# EAGLE schematic MainECU rev14 (EAGLE 9.6.2)

## Sheet 1 of 8
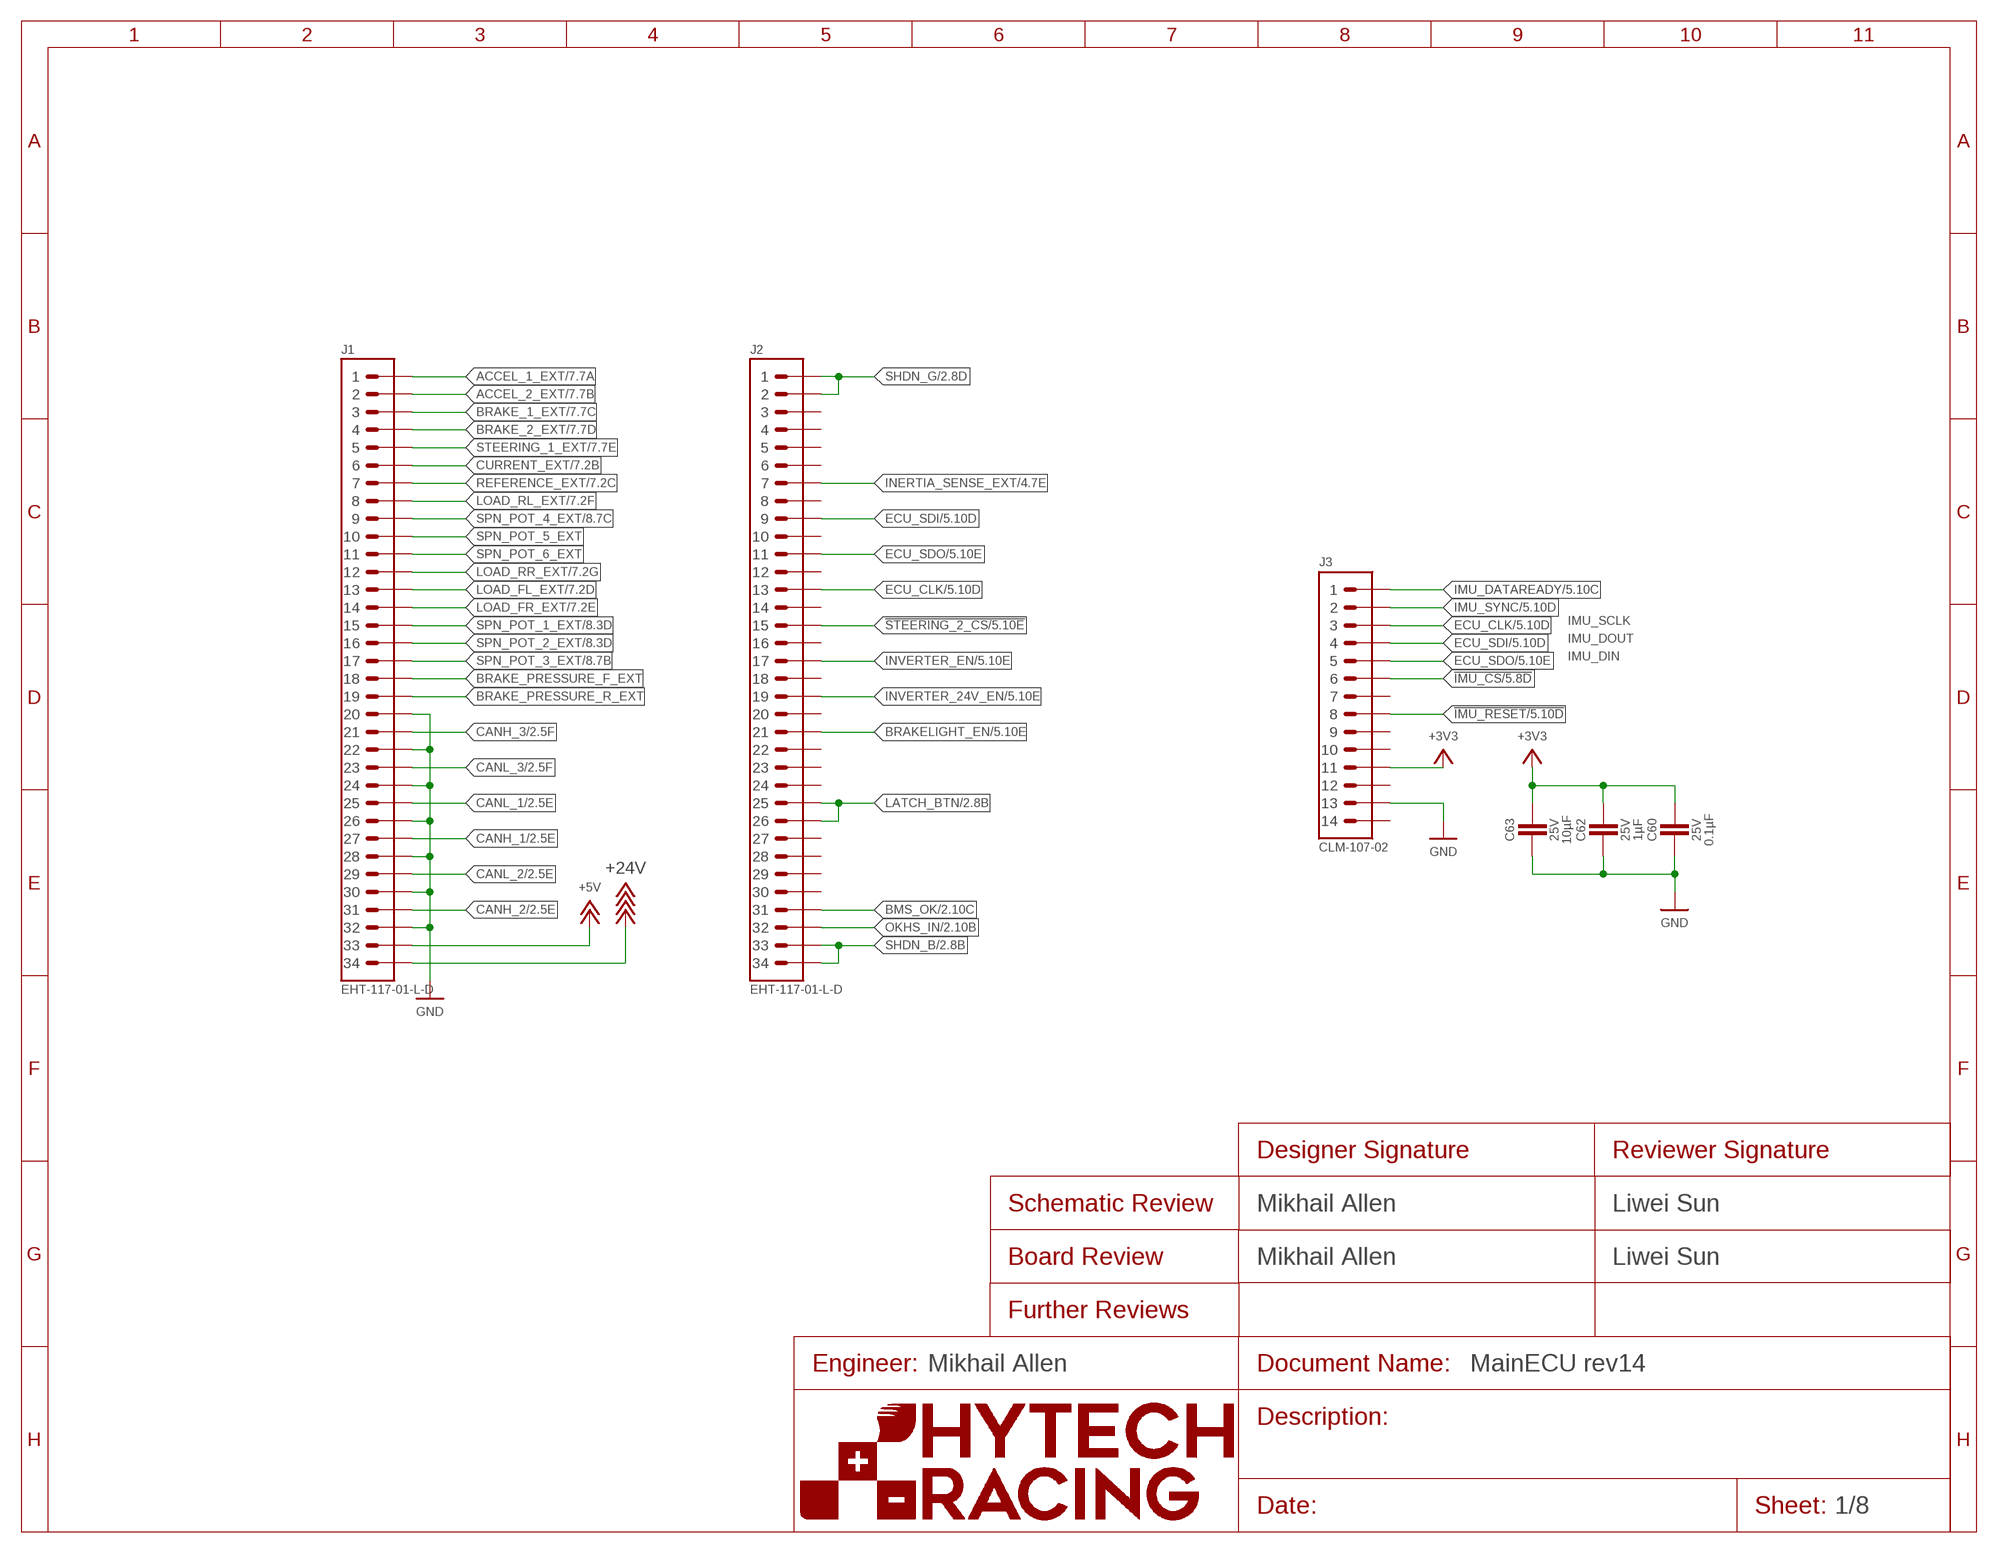
[diagram p0: schematic, sheet 1]
FRAME8 (FRAME): DESIGNER_BOARD: Mikhail Allen; DESIGNER_SCHEMATIC: Mikhail Allen; ENGINEER: Mikhail Allen; REVIEWER_BOARD: Liwei Sun; REVIEWER_SCHEMATIC: Liwei Sun

### Parts
C60  CAPACITOR_0603_25V_0.1UF  [0603-CAP]
C62  CAPACITOR_0603_25V_1UF  [0603-CAP]
C63  CAPACITOR_0603_25V_10UF  [0603-CAP]
J1  CONNECTOR-34__  [EHT-117-01]
J2  CONNECTOR-34__  [EHT-117-01]
J3  ADIS16460  [ADIS16460]

### Nets
!IMU_CS: J3.6 ; also sheet 5
!IMU_RESET: J3.8 ; also sheet 5
!STEERING_2_CS: J2.15 ; also sheet 5
+3V3: C60.1 C62.1 C63.1 J3.11 ; also sheet 2,3,4,5,6
+5V: J1.33 ; also sheet 2,3,5,6,7
+24V: J1.34 ; also sheet 2,3,4,5
ACCEL_1_EXT: J1.1 ; also sheet 7
ACCEL_2_EXT: J1.2 ; also sheet 7
BMS_OK: J2.31 ; also sheet 2,4
BRAKE_1_EXT: J1.3 ; also sheet 7
BRAKE_2_EXT: J1.4 ; also sheet 7
BRAKE_PRESSURE_F_EXT: J1.18
BRAKE_PRESSURE_R_EXT: J1.19
BRAKELIGHT_EN: J2.21 ; also sheet 5
CANH_1: J1.27 ; also sheet 2,5,6
CANH_2: J1.31 ; also sheet 2,5,6
CANH_3: J1.21 ; also sheet 2,5,6
CANL_1: J1.25 ; also sheet 2,5,6
CANL_2: J1.29 ; also sheet 2,5,6
CANL_3: J1.23 ; also sheet 2,5,6
CURRENT_EXT: J1.6 ; also sheet 7
ECU_CLK: J2.13 J3.3 ; also sheet 5
ECU_SDI: J2.9 J3.4 ; also sheet 5
ECU_SDO: J2.11 J3.5 ; also sheet 5
GND: C60.2 C62.2 C63.2 J1.20 J1.22 J1.24 J1.26 J1.28 J1.30 J1.32 J3.13 ; also sheet 2,3,4,5,6,7,8
IMU_DATAREADY: J3.1 ; also sheet 5
IMU_SYNC: J3.2 ; also sheet 5
INERTIA_SENSE_EXT: J2.7 ; also sheet 4
INVERTER_24V_EN: J2.19 ; also sheet 5
INVERTER_EN: J2.17 ; also sheet 5
LATCH_BTN: J2.25 J2.26 ; also sheet 2,4
LOAD_FL_EXT: J1.13 ; also sheet 7
LOAD_FR_EXT: J1.14 ; also sheet 7
LOAD_RL_EXT: J1.8 ; also sheet 7
LOAD_RR_EXT: J1.12 ; also sheet 7
OKHS_IN: J2.32 ; also sheet 2,4
REFERENCE_EXT: J1.7 ; also sheet 7
SHDN_B: J2.33 J2.34 ; also sheet 2,4
SHDN_G: J2.1 J2.2 ; also sheet 2,4
SPN_POT_1_EXT: J1.15 ; also sheet 8
SPN_POT_2_EXT: J1.16 ; also sheet 8
SPN_POT_3_EXT: J1.17 ; also sheet 8
SPN_POT_4_EXT: J1.9 ; also sheet 8
SPN_POT_5_EXT: J1.10
SPN_POT_6_EXT: J1.11
STEERING_1_EXT: J1.5 ; also sheet 7
Unconnected: J2.3 J2.4 J2.5 J2.6 J2.8 J2.10 J2.12 J2.14 J2.16 J2.18 J2.20 J2.22 J2.23 J2.24 J2.27 J2.28 J2.29 J2.30 J3.7 J3.9 J3.10 J3.12 J3.14

### Notes on the sheet
- IMU_SCLK
- IMU_DOUT
- IMU_DIN

## Sheet 2 of 8
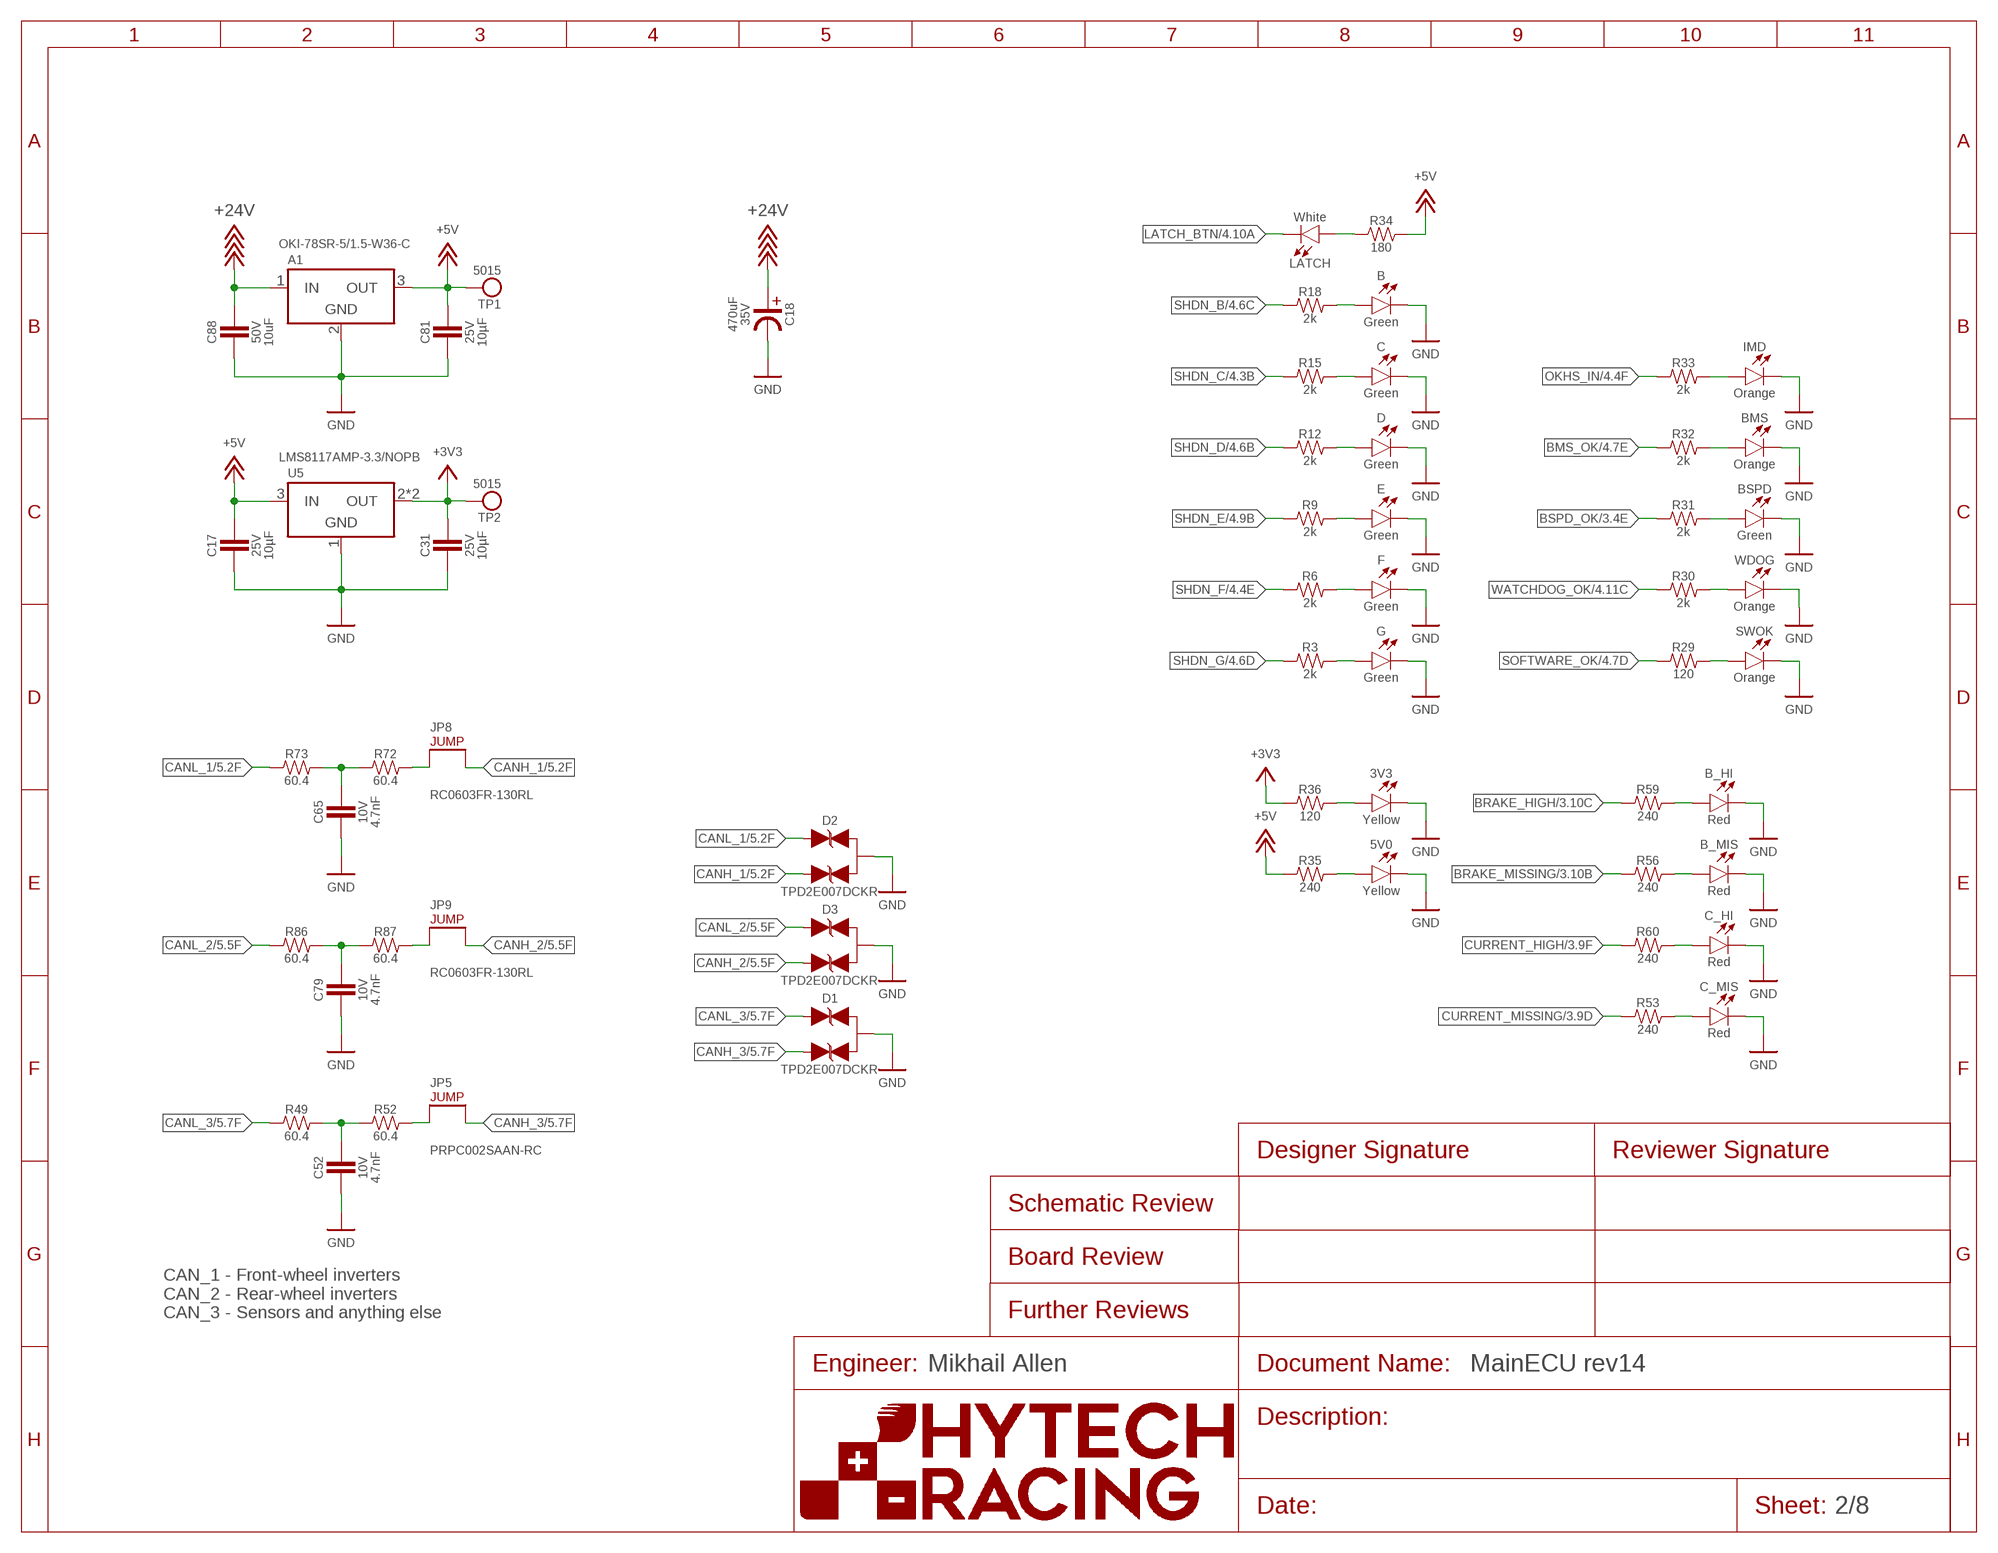
[diagram p1: schematic, sheet 2]
FRAME1 (FRAME): ENGINEER: Mikhail Allen

### Parts
3V3  LED_0603_YELLOW  [0603-LED]
5V0  LED_0603_YELLOW  [0603-LED]
A1  VOLTAGE_REGULATOR_MODULE_OKI-78SR_5V  [OKI-78SR]
B  LED_0603_GREEN  [0603-LED]
B_HI  LED_0603_RED  [0603-LED]
B_MIS  LED_0603_RED  [0603-LED]
BMS  LED_0603_ORANGE  [0603-LED]
BSPD  LED_0603_GREEN  [0603-LED]
C  LED_0603_GREEN  [0603-LED]
C17  CAPACITOR_0603_25V_10UF  [0603-CAP]
C18  CAPACITOR_ELECTROLYTIC_EEH_AZS_470UF  [EEH-AZS]
C31  CAPACITOR_0603_25V_10UF  [0603-CAP]
C52  CAPACITOR_0603_10V_4.7NF  [0603-CAP]
C65  CAPACITOR_0603_10V_4.7NF  [0603-CAP]
C79  CAPACITOR_0603_10V_4.7NF  [0603-CAP]
C81  CAPACITOR_0603_25V_10UF  [0603-CAP]
C88  CAPACITOR_0805_50V_10UF  [0805-CAP]
C_HI  LED_0603_RED  [0603-LED]
C_MIS  LED_0603_RED  [0603-LED]
D  LED_0603_GREEN  [0603-LED]
D1  TVS_BIDIRECTIONAL_DUAL  [SC-70-3]
D2  TVS_BIDIRECTIONAL_DUAL  [SC-70-3]
D3  TVS_BIDIRECTIONAL_DUAL  [SC-70-3]
E  LED_0603_GREEN  [0603-LED]
F  LED_0603_GREEN  [0603-LED]
G  LED_0603_GREEN  [0603-LED]
IMD  LED_0603_ORANGE  [0603-LED]
JP5  JUMPER__1X02  [1X02]
JP8  JUMPER_0603_  [0603-RES]
JP9  JUMPER_0603_  [0603-RES]
LATCH  LED_0603_WHITE  [0603-LED]
R3  RESISTOR_0603_2K  [0603-RES]
R6  RESISTOR_0603_2K  [0603-RES]
R9  RESISTOR_0603_2K  [0603-RES]
R12  RESISTOR_0603_2K  [0603-RES]
R15  RESISTOR_0603_2K  [0603-RES]
R18  RESISTOR_0603_2K  [0603-RES]
R29  RESISTOR_0603_120  [0603-RES]
R30  RESISTOR_0603_2K  [0603-RES]
R31  RESISTOR_0603_2K  [0603-RES]
R32  RESISTOR_0603_2K  [0603-RES]
R33  RESISTOR_0603_2K  [0603-RES]
R34  RESISTOR_0603_180  [0603-RES]
R35  RESISTOR_0603_240  [0603-RES]
R36  RESISTOR_0603_120  [0603-RES]
R49  RESISTOR_0603_60.4  [0603-RES]
R52  RESISTOR_0603_60.4  [0603-RES]
R53  RESISTOR_0603_240  [0603-RES]
R56  RESISTOR_0603_240  [0603-RES]
R59  RESISTOR_0603_240  [0603-RES]
R60  RESISTOR_0603_240  [0603-RES]
R72  RESISTOR_0603_60.4  [0603-RES]
R73  RESISTOR_0603_60.4  [0603-RES]
R86  RESISTOR_0603_60.4  [0603-RES]
R87  RESISTOR_0603_60.4  [0603-RES]
SWOK  LED_0603_ORANGE  [0603-LED]
TP1  TEST_POINT  [5015]
TP2  TEST_POINT  [5015]
U5  VOLTAGE_REGULATOR_SOT-223_3.3V  [SOT-223]
WDOG  LED_0603_ORANGE  [0603-LED]

### Nets
+3V3: C31.1 R36.1 TP2.1 U5.2(OUT) U5.4(OUT) ; also sheet 1,3,4,5,6
+5V: A1.3(OUT) C17.1 C81.1 R34.2 R35.1 TP1.1 U5.3(IN) ; also sheet 1,3,5,6,7
+24V: A1.1(IN) C18.PLUS C88.1 ; also sheet 1,3,4,5
BMS_OK: R32.1 ; also sheet 1,4
BRAKE_HIGH: R59.1 ; also sheet 3
BRAKE_MISSING: R56.1 ; also sheet 3
BSPD_OK: R31.1 ; also sheet 3,4
CANH_1: D2.2(C2) JP8.2 ; also sheet 1,5,6
CANH_2: D3.2(C2) JP9.2 ; also sheet 1,5,6
CANH_3: D1.2(C2) JP5.2 ; also sheet 1,5,6
CANL_1: D2.1(C1) R73.1 ; also sheet 1,5,6
CANL_2: D3.1(C1) R86.1 ; also sheet 1,5,6
CANL_3: D1.1(C1) R49.1 ; also sheet 1,5,6
CURRENT_HIGH: R60.1 ; also sheet 3
CURRENT_MISSING: R53.1 ; also sheet 3
GND: 3V3.1(C) 5V0.1(C) A1.2(GND) B.1(C) B_HI.1(C) B_MIS.1(C) BMS.1(C) BSPD.1(C) C17.2 C18.MINUS C31.2 C52.2 C65.2 C79.2 C81.2 C88.2 C.1(C) C_HI.1(C) C_MIS.1(C) D1.3(A) D2.3(A) D3.3(A) D.1(C) E.1(C) F.1(C) G.1(C) IMD.1(C) SWOK.1(C) U5.1(GND) WDOG.1(C) ; also sheet 1,3,4,5,6,7,8
LATCH_BTN: LATCH.1(C) ; also sheet 1,4
N$1: JP8.1 R72.2
N$2: JP9.1 R87.2
N$6: JP5.1 R52.2
N$7: C79.1 R86.2 R87.1
N$8: C52.1 R49.2 R52.1
N$9: C65.1 R72.1 R73.2
N$13: G.2(A) R3.2
N$15: LATCH.2(A) R34.1
N$16: B.2(A) R18.2
N$17: C.2(A) R15.2
N$18: D.2(A) R12.2
N$19: E.2(A) R9.2
N$20: F.2(A) R6.2
N$28: B_MIS.2(A) R56.2
N$29: C_HI.2(A) R60.2
N$30: C_MIS.2(A) R53.2
N$40: IMD.2(A) R33.2
N$41: BMS.2(A) R32.2
N$42: BSPD.2(A) R31.2
N$43: R30.2 WDOG.2(A)
N$44: 3V3.2(A) R36.2
N$45: R29.2 SWOK.2(A)
N$47: 5V0.2(A) R35.2
N$56: B_HI.2(A) R59.2
OKHS_IN: R33.1 ; also sheet 1,4
SHDN_B: R18.1 ; also sheet 1,4
SHDN_C: R15.1 ; also sheet 4
SHDN_D: R12.1 ; also sheet 4
SHDN_E: R9.1 ; also sheet 4
SHDN_F: R6.1 ; also sheet 4
SHDN_G: R3.1 ; also sheet 1,4
SOFTWARE_OK: R29.1 ; also sheet 4,5
WATCHDOG_OK: R30.1 ; also sheet 4

### Notes on the sheet
- CAN_1 - Front-wheel inverters
  CAN_2 - Rear-wheel inverters
  CAN_3 - Sensors and anything else

## Sheet 3 of 8
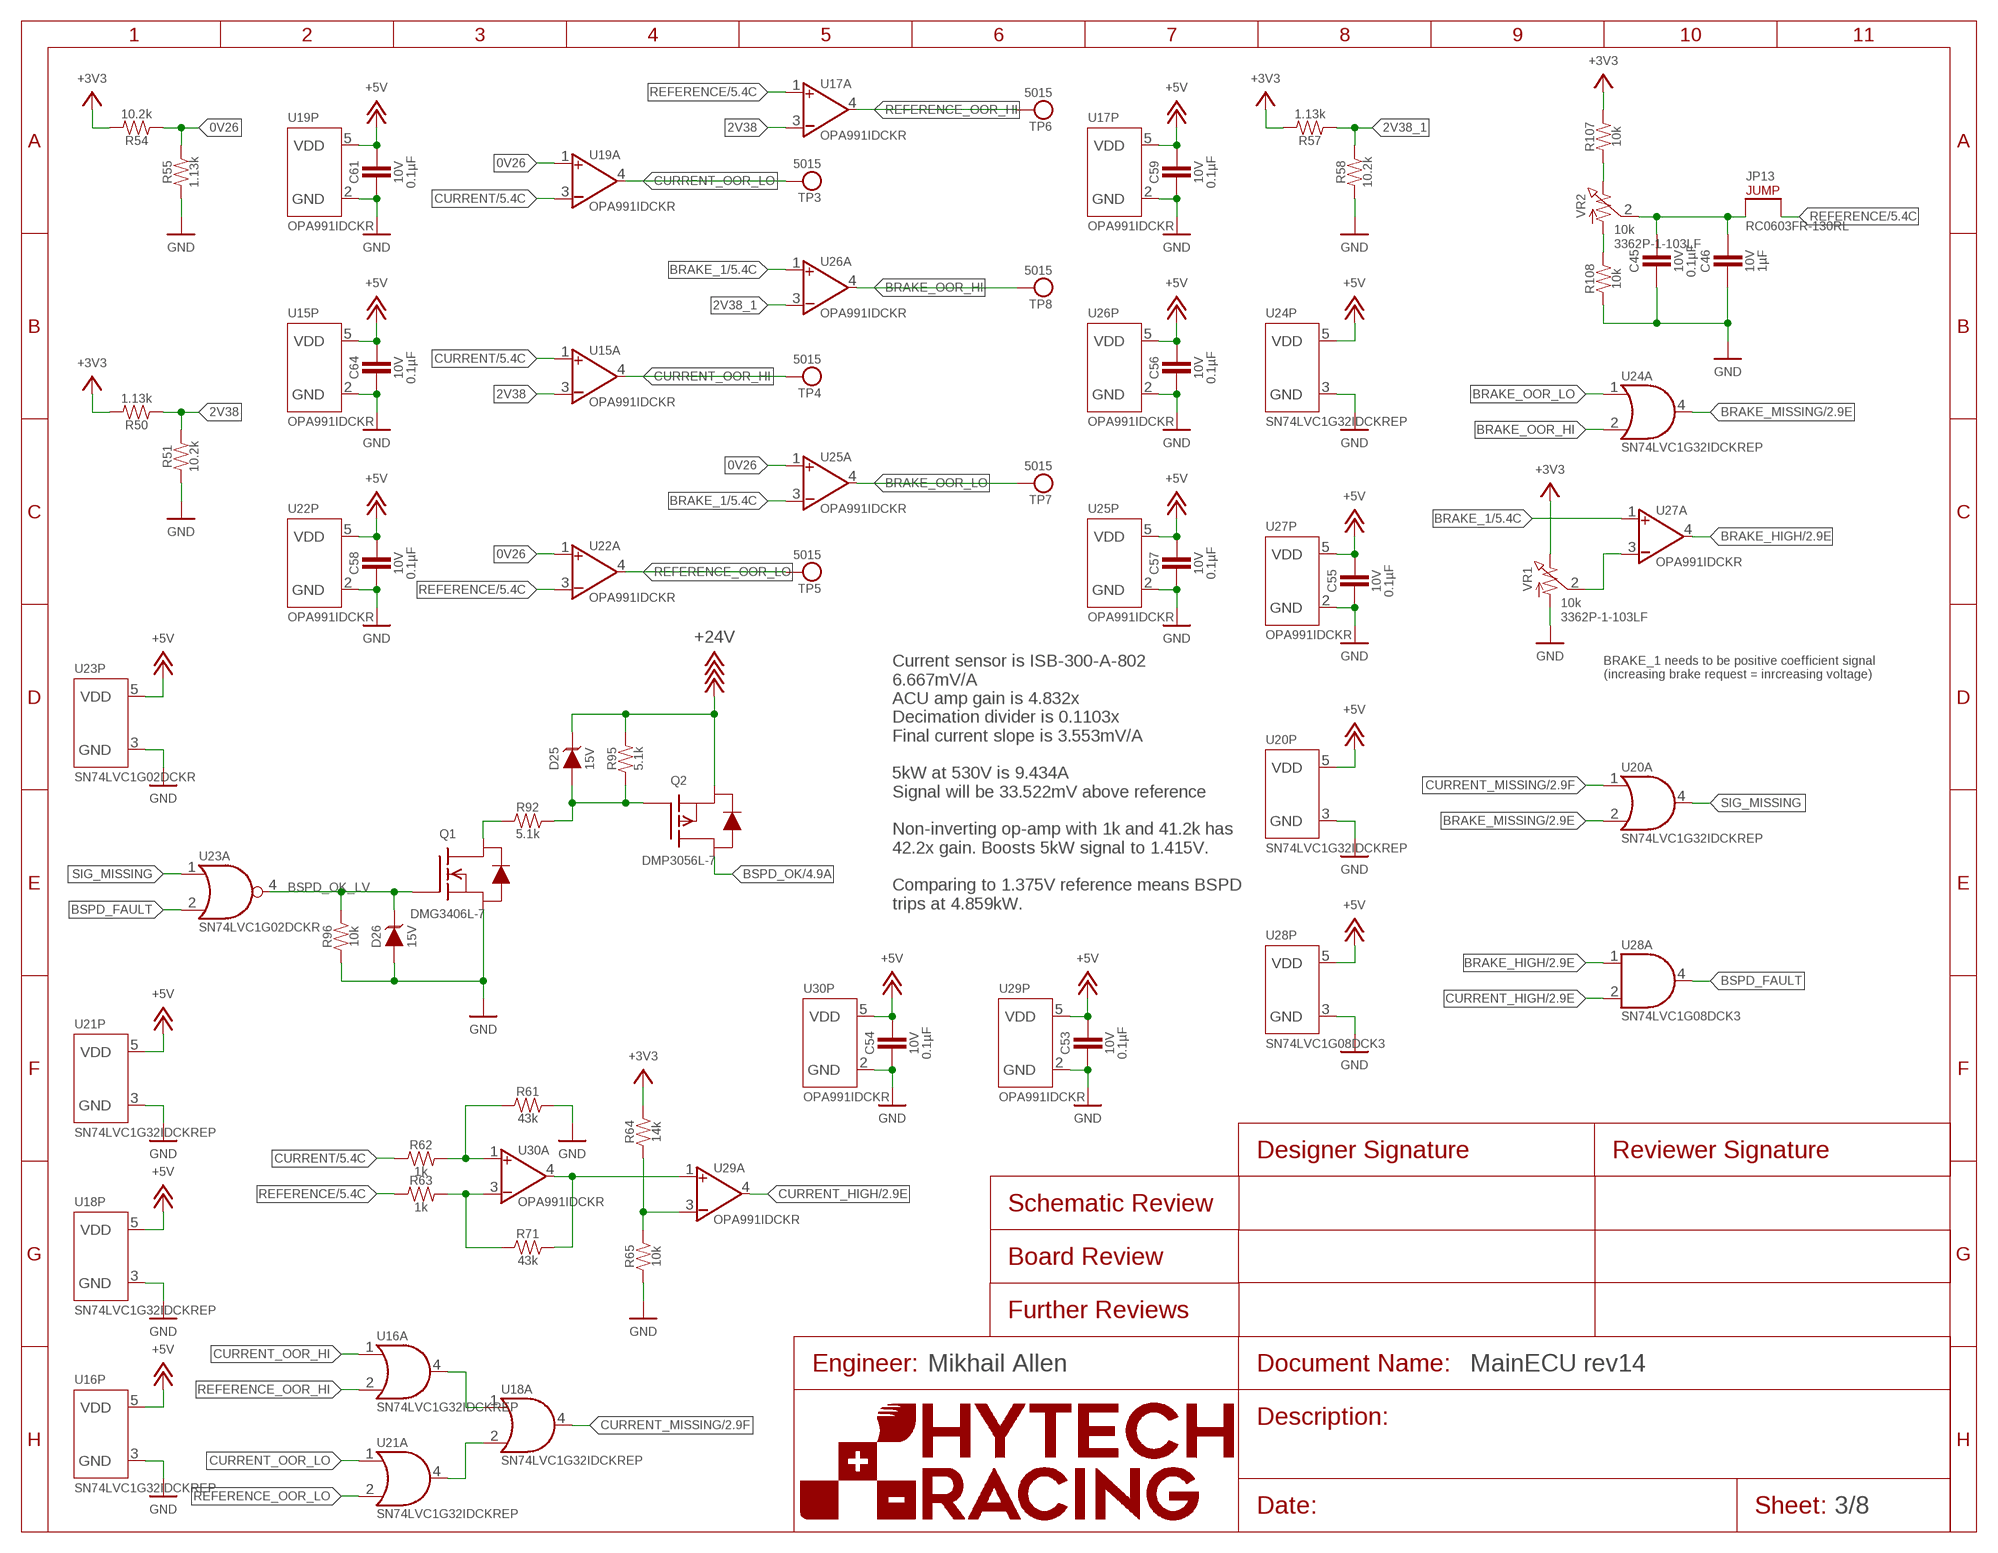
[diagram p2: schematic, sheet 3]
FRAME7 (FRAME): ENGINEER: Mikhail Allen

### Parts
C45  CAPACITOR_0603_10V_0.1UF  [0603-CAP]
C46  CAPACITOR_0603_10V_1UF  [0603-CAP]
C53  CAPACITOR_0603_10V_0.1UF  [0603-CAP]
C54  CAPACITOR_0603_10V_0.1UF  [0603-CAP]
C55  CAPACITOR_0603_10V_0.1UF  [0603-CAP]
C56  CAPACITOR_0603_10V_0.1UF  [0603-CAP]
C57  CAPACITOR_0603_10V_0.1UF  [0603-CAP]
C58  CAPACITOR_0603_10V_0.1UF  [0603-CAP]
C59  CAPACITOR_0603_10V_0.1UF  [0603-CAP]
C61  CAPACITOR_0603_10V_0.1UF  [0603-CAP]
C64  CAPACITOR_0603_10V_0.1UF  [0603-CAP]
D25  TVS__15V  [SOT-23]
D26  TVS__15V  [SOT-23]
JP13  DNP  JUMPER_0603_  [0603-RES]
Q1  TRANSISTOR_N_MOS__DMG3406L-7  [SOT-23]
Q2  TRANSISTOR_P_MOS_SOT-23_DMP3056L-7  [SOT-23]
R50  RESISTOR_0603_1.13K  [0603-RES]
R51  RESISTOR_0603_10.2K  [0603-RES]
R54  RESISTOR_0603_10.2K  [0603-RES]
R55  RESISTOR_0603_1.13K  [0603-RES]
R57  RESISTOR_0603_1.13K  [0603-RES]
R58  RESISTOR_0603_10.2K  [0603-RES]
R61  RESISTOR_0603_43K  [0603-RES]
R62  RESISTOR_0603_1K  [0603-RES]
R63  RESISTOR_0603_1K  [0603-RES]
R64  RESISTOR_0603_14K  [0603-RES]
R65  RESISTOR_0603_10K  [0603-RES]
R71  RESISTOR_0603_43K  [0603-RES]
R92  RESISTOR_0603_5.1K  [0603-RES]
R95  RESISTOR_0603_5.1K  [0603-RES]
R96  RESISTOR_0603_10K  [0603-RES]
R107  RESISTOR_0603_10K  [0603-RES]
R108  RESISTOR_0603_10K  [0603-RES]
TP3  TEST_POINT  [5015]
TP4  TEST_POINT  [5015]
TP5  TEST_POINT  [5015]
TP6  TEST_POINT  [5015]
TP7  TEST_POINT  [5015]
TP8  TEST_POINT  [5015]
U15  OPAMP_1_CHANNEL_OPA991  [SC-70-5]
U16  LOGICGATE_OR  [SC-70-5]
U17  OPAMP_1_CHANNEL_OPA991  [SC-70-5]
U18  LOGICGATE_OR  [SC-70-5]
U19  OPAMP_1_CHANNEL_OPA991  [SC-70-5]
U20  LOGICGATE_OR  [SC-70-5]
U21  LOGICGATE_OR  [SC-70-5]
U22  OPAMP_1_CHANNEL_OPA991  [SC-70-5]
U23  LOGICGATE_NOR  [SC-70-5]
U24  LOGICGATE_OR  [SC-70-5]
U25  OPAMP_1_CHANNEL_OPA991  [SC-70-5]
U26  OPAMP_1_CHANNEL_OPA991  [SC-70-5]
U27  OPAMP_1_CHANNEL_OPA991  [SC-70-5]
U28  LOGICGATE_AND_DCK3  [SC-70-5]
U29  OPAMP_1_CHANNEL_OPA991  [SC-70-5]
U30  OPAMP_1_CHANNEL_OPA991  [SC-70-5]
VR1  RESISTOR_TRIMPOT_10K_3362P  [3362P]
VR2  RESISTOR_TRIMPOT_10K_3362P  [3362P]

### Nets
0V26: R54.1 R55.2 U19.1(A:VIN+) U22.1(A:VIN+) U25.1(A:VIN+)
2V38: R50.1 R51.2 U15.3(A:VIN-) U17.3(A:VIN-)
2V38_1: R57.1 R58.2 U26.3(A:VIN-)
+3V3: R50.2 R54.2 R57.2 R64.2 R107.2 VR1.3 ; also sheet 1,2,4,5,6
+5V: C53.1 C54.1 C55.1 C56.1 C57.1 C58.1 C59.1 C61.1 C64.1 U15.5(P:VDD) U16.5(P:VDD) U17.5(P:VDD) U18.5(P:VDD) U19.5(P:VDD) U20.5(P:VDD) U21.5(P:VDD) U22.5(P:VDD) U23.5(P:VDD) U24.5(P:VDD) U25.5(P:VDD) U26.5(P:VDD) U27.5(P:VDD) U28.5(P:VDD) U29.5(P:VDD) U30.5(P:VDD) ; also sheet 1,2,5,6,7
+24V: D25.3(C) Q2.2(S) R95.2 ; also sheet 1,2,4,5
BRAKE_1: U25.3(A:VIN-) U26.1(A:VIN+) U27.1(A:VIN+) ; also sheet 5,7
BRAKE_HIGH: U27.4(A:VOUT) U28.1(A:IN1) ; also sheet 2
BRAKE_MISSING: U20.2(A:IN2) U24.4(A:OUT) ; also sheet 2
BRAKE_OOR_HI: TP8.1 U24.2(A:IN2) U26.4(A:VOUT)
BRAKE_OOR_LO: TP7.1 U24.1(A:IN1) U25.4(A:VOUT)
BSPD_FAULT: U23.2(A:IN2) U28.4(A:OUT)
BSPD_OK: Q2.3(D) ; also sheet 2,4
BSPD_OK_LV: D26.3(C) Q1.1(G) R96.2 U23.4(A:OUT)
CURRENT: R62.1 U15.1(A:VIN+) U19.3(A:VIN-) ; also sheet 5,6,7
CURRENT_HIGH: U28.2(A:IN2) U29.4(A:VOUT) ; also sheet 2
CURRENT_MISSING: U18.4(A:OUT) U20.1(A:IN1) ; also sheet 2
CURRENT_OOR_HI: TP4.1 U15.4(A:VOUT) U16.1(A:IN1)
CURRENT_OOR_LO: TP3.1 U19.4(A:VOUT) U21.1(A:IN1)
GND: C45.2 C46.2 C53.2 C54.2 C55.2 C56.2 C57.2 C58.2 C59.2 C61.2 C64.2 D26.1(A) Q1.2(S) R51.1 R55.1 R58.1 R61.2 R65.1 R96.1 R108.1 U15.2(P:GND) U16.3(P:GND) U17.2(P:GND) U18.3(P:GND) U19.2(P:GND) U20.3(P:GND) U21.3(P:GND) U22.2(P:GND) U23.3(P:GND) U24.3(P:GND) U25.2(P:GND) U26.2(P:GND) U27.2(P:GND) U28.3(P:GND) U29.2(P:GND) U30.2(P:GND) VR1.1 ; also sheet 1,2,4,5,6,7,8
N$26: R61.1 R62.2 U30.1(A:VIN+)
N$39: R107.1 VR2.3
N$46: C45.1 C46.1 JP13.1 VR2.2
N$48: R108.2 VR2.1
N$65: R64.1 R65.2 U29.3(A:VIN-)
N$67: R63.2 R71.1 U30.3(A:VIN-)
N$68: R71.2 U29.1(A:VIN+) U30.4(A:VOUT)
N$73: U27.3(A:VIN-) VR1.2
N$74: D25.1(A) Q2.1(G) R92.2 R95.1
N$75: Q1.3(D) R92.1
OOR_HI: U16.4(A:OUT) U18.1(A:IN1)
OOR_LO: U18.2(A:IN2) U21.4(A:OUT)
REFERENCE: JP13.2 R63.1 U17.1(A:VIN+) U22.3(A:VIN-) ; also sheet 5,6,7
REFERENCE_OOR_HI: TP6.1 U16.2(A:IN2) U17.4(A:VOUT)
REFERENCE_OOR_LO: TP5.1 U21.2(A:IN2) U22.4(A:VOUT)
SIG_MISSING: U20.4(A:OUT) U23.1(A:IN1)

### Notes on the sheet
- BRAKE_1 needs to be positive coefficient signal
  (increasing brake request = inrcreasing voltage)
- Current sensor is ISB-300-A-802
  6.667mV/A
  ACU amp gain is 4.832x
  Decimation divider is 0.1103x
  Final current slope is 3.553mV/A
  
  5kW at 530V is 9.434A
  Signal will be 33.522mV above reference
  
  Non-inverting op-amp with 1k and 41.2k has
  42.2x gain. Boosts 5kW signal to 1.415V.
  
  Comparing to 1.375V reference means BSPD
  trips at 4.859kW.

## Sheet 4 of 8
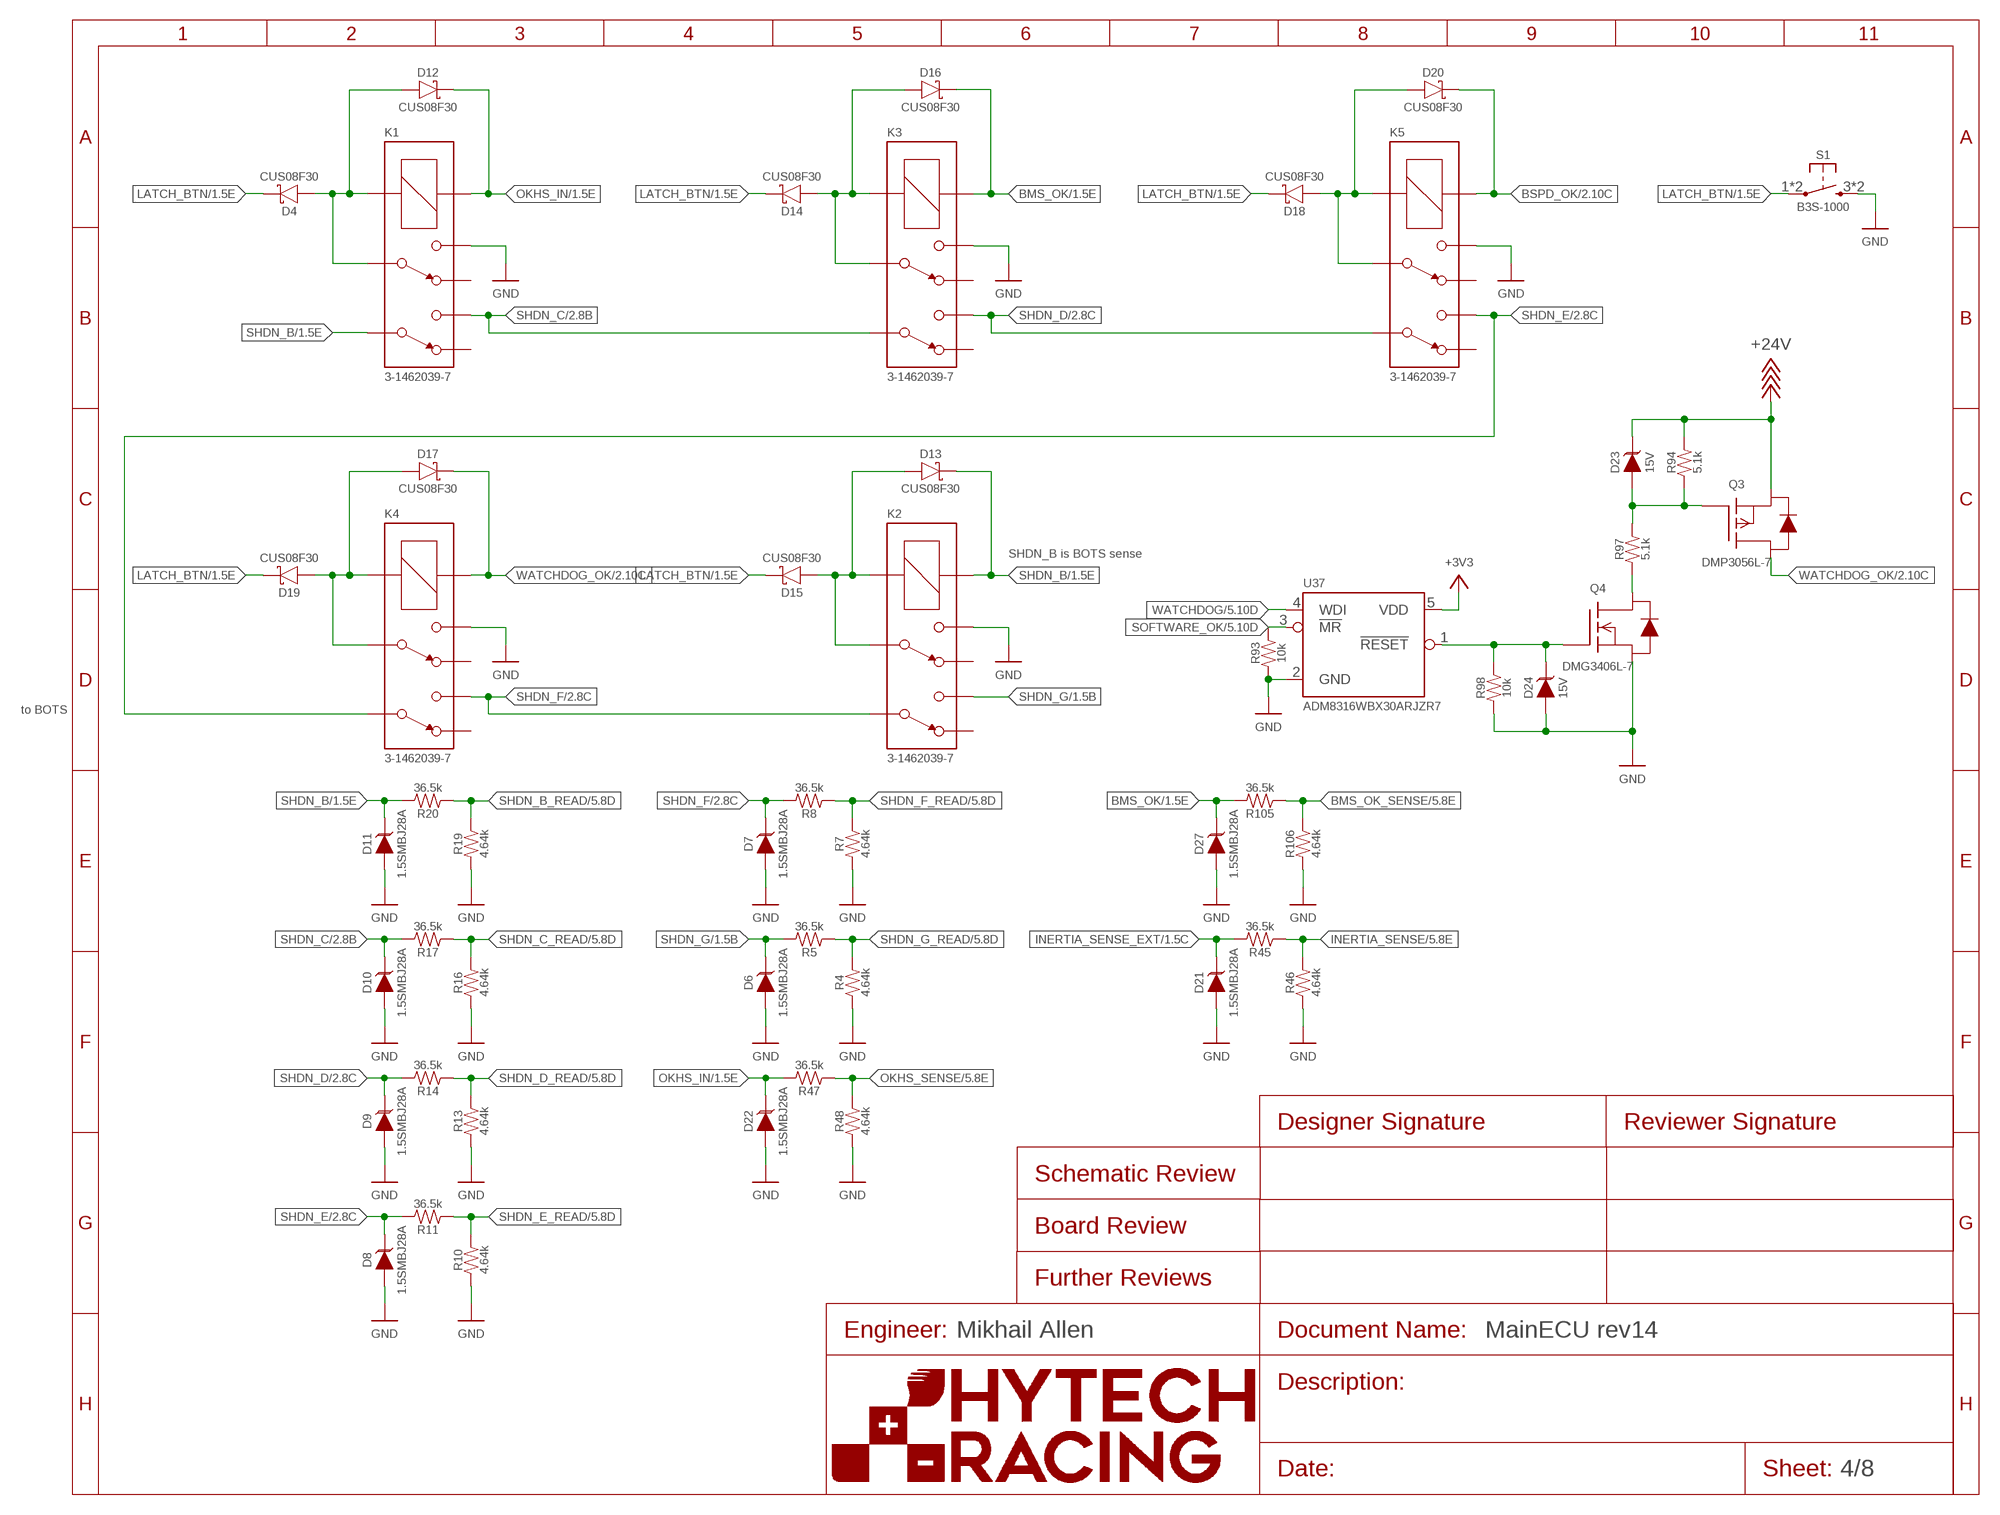
[diagram p3: schematic, sheet 4]
FRAME2 (FRAME): ENGINEER: Mikhail Allen

### Parts
D4  SCHOTTKY_SOD323_30V  [SOD-323]
D6  TVS_DO-214AA_28V  [DO-214AA]
D7  TVS_DO-214AA_28V  [DO-214AA]
D8  TVS_DO-214AA_28V  [DO-214AA]
D9  TVS_DO-214AA_28V  [DO-214AA]
D10  TVS_DO-214AA_28V  [DO-214AA]
D11  TVS_DO-214AA_28V  [DO-214AA]
D12  SCHOTTKY_SOD323_30V  [SOD-323]
D13  SCHOTTKY_SOD323_30V  [SOD-323]
D14  SCHOTTKY_SOD323_30V  [SOD-323]
D15  SCHOTTKY_SOD323_30V  [SOD-323]
D16  SCHOTTKY_SOD323_30V  [SOD-323]
D17  SCHOTTKY_SOD323_30V  [SOD-323]
D18  SCHOTTKY_SOD323_30V  [SOD-323]
D19  SCHOTTKY_SOD323_30V  [SOD-323]
D20  SCHOTTKY_SOD323_30V  [SOD-323]
D21  TVS_DO-214AA_28V  [DO-214AA]
D22  TVS_DO-214AA_28V  [DO-214AA]
D23  TVS__15V  [SOT-23]
D24  TVS__15V  [SOT-23]
D27  TVS_DO-214AA_28V  [DO-214AA]
K1  RELAY_DPDT_07DSMT  [IM*G]
K2  RELAY_DPDT_07DSMT  [IM*G]
K3  RELAY_DPDT_07DSMT  [IM*G]
K4  RELAY_DPDT_07DSMT  [IM*G]
K5  RELAY_DPDT_07DSMT  [IM*G]
Q3  TRANSISTOR_P_MOS_SOT-23_DMP3056L-7  [SOT-23]
Q4  TRANSISTOR_N_MOS__DMG3406L-7  [SOT-23]
R4  RESISTOR_0603_4.64K  [0603-RES]
R5  RESISTOR_0603_36.5K  [0603-RES]
R7  RESISTOR_0603_4.64K  [0603-RES]
R8  RESISTOR_0603_36.5K  [0603-RES]
R10  RESISTOR_0603_4.64K  [0603-RES]
R11  RESISTOR_0603_36.5K  [0603-RES]
R13  RESISTOR_0603_4.64K  [0603-RES]
R14  RESISTOR_0603_36.5K  [0603-RES]
R16  RESISTOR_0603_4.64K  [0603-RES]
R17  RESISTOR_0603_36.5K  [0603-RES]
R19  RESISTOR_0603_4.64K  [0603-RES]
R20  RESISTOR_0603_36.5K  [0603-RES]
R45  RESISTOR_0603_36.5K  [0603-RES]
R46  RESISTOR_0603_4.64K  [0603-RES]
R47  RESISTOR_0603_36.5K  [0603-RES]
R48  RESISTOR_0603_4.64K  [0603-RES]
R93  RESISTOR_0603_10K  [0603-RES]
R94  RESISTOR_0603_5.1K  [0603-RES]
R97  RESISTOR_0603_5.1K  [0603-RES]
R98  RESISTOR_0603_10K  [0603-RES]
R105  RESISTOR_0603_36.5K  [0603-RES]
R106  RESISTOR_0603_4.64K  [0603-RES]
S1  BUTTON  [B3S-100X]
U37  ADM8316WBX30  [SOT-23-5]

### Nets
+3V3: U37.5(VDD) ; also sheet 1,2,3,5,6
+24V: D23.3(C) Q3.2(S) R94.2 ; also sheet 1,2,3,5
BMS_OK: D16.C D27.2(C) K3.1(COIL+) R105.2 ; also sheet 1,2
BMS_OK_SENSE: R105.1 R106.2 ; also sheet 5
BSPD_OK: D20.C K5.1(COIL+) ; also sheet 2,3
GND: D6.1(A) D7.1(A) D8.1(A) D9.1(A) D10.1(A) D11.1(A) D21.1(A) D22.1(A) D24.1(A) D27.1(A) K1.4 K2.4 K3.4 K4.4 K5.4 Q4.2(S) R4.1 R7.1 R10.1 R13.1 R16.1 R19.1 R46.1 R48.1 R93.1 R98.1 R106.1 S1.3(S) S1.4(S) U37.2(GND) ; also sheet 1,2,3,5,6,7,8
INERTIA_SENSE: R45.1 R46.2 ; also sheet 5
INERTIA_SENSE_EXT: D21.2(C) R45.2 ; also sheet 1
LATCH_BTN: D4.C D14.C D15.C D18.C D19.C S1.1(P) S1.2(P) ; also sheet 1,2
N$4: D23.1(A) Q3.1(G) R94.1 R97.2
N$5: Q4.3(D) R97.1
N$21: D4.A D12.A K1.3 K1.8(COIL-)
N$22: D18.A D20.A K5.3 K5.8(COIL-)
N$23: D14.A D16.A K3.3 K3.8(COIL-)
N$24: D13.A D15.A K2.3 K2.8(COIL-)
N$25: D17.A D19.A K4.3 K4.8(COIL-)
OKHS_IN: D12.C D22.2(C) K1.1(COIL+) R47.2 ; also sheet 1,2
OKHS_SENSE: R47.1 R48.2 ; also sheet 5
SHDN_B: D11.2(C) D13.C K1.6 K2.1(COIL+) R20.2 ; also sheet 1,2
SHDN_B_READ: R19.2 R20.1 ; also sheet 5
SHDN_C: D10.2(C) K1.5 K3.6 R17.2 ; also sheet 2
SHDN_C_READ: R16.2 R17.1 ; also sheet 5
SHDN_D: D9.2(C) K3.5 K5.6 R14.2 ; also sheet 2
SHDN_D_READ: R13.2 R14.1 ; also sheet 5
SHDN_E: D8.2(C) K4.6 K5.5 R11.2 ; also sheet 2
SHDN_E_READ: R10.2 R11.1 ; also sheet 5
SHDN_F: D7.2(C) K2.6 K4.5 R8.2 ; also sheet 2
SHDN_F_READ: R7.2 R8.1 ; also sheet 5
SHDN_G: D6.2(C) K2.5 R5.2 ; also sheet 1,2
SHDN_G_READ: R4.2 R5.1 ; also sheet 5
SOFTWARE_OK: R93.2 U37.3(!MR!) ; also sheet 2,5
WATCHDOG: U37.4(WDI) ; also sheet 5
WATCHDOG_OK: D17.C K4.1(COIL+) Q3.3(D) ; also sheet 2
WATCHDOG_OK_LV: D24.3(C) Q4.1(G) R98.2 U37.1(!RESET!)
Unconnected: K1.2 K1.7 K2.2 K2.7 K3.2 K3.7 K4.2 K4.7 K5.2 K5.7

### Notes on the sheet
- SHDN_B is BOTS sense
- to BOTS

## Sheet 5 of 8
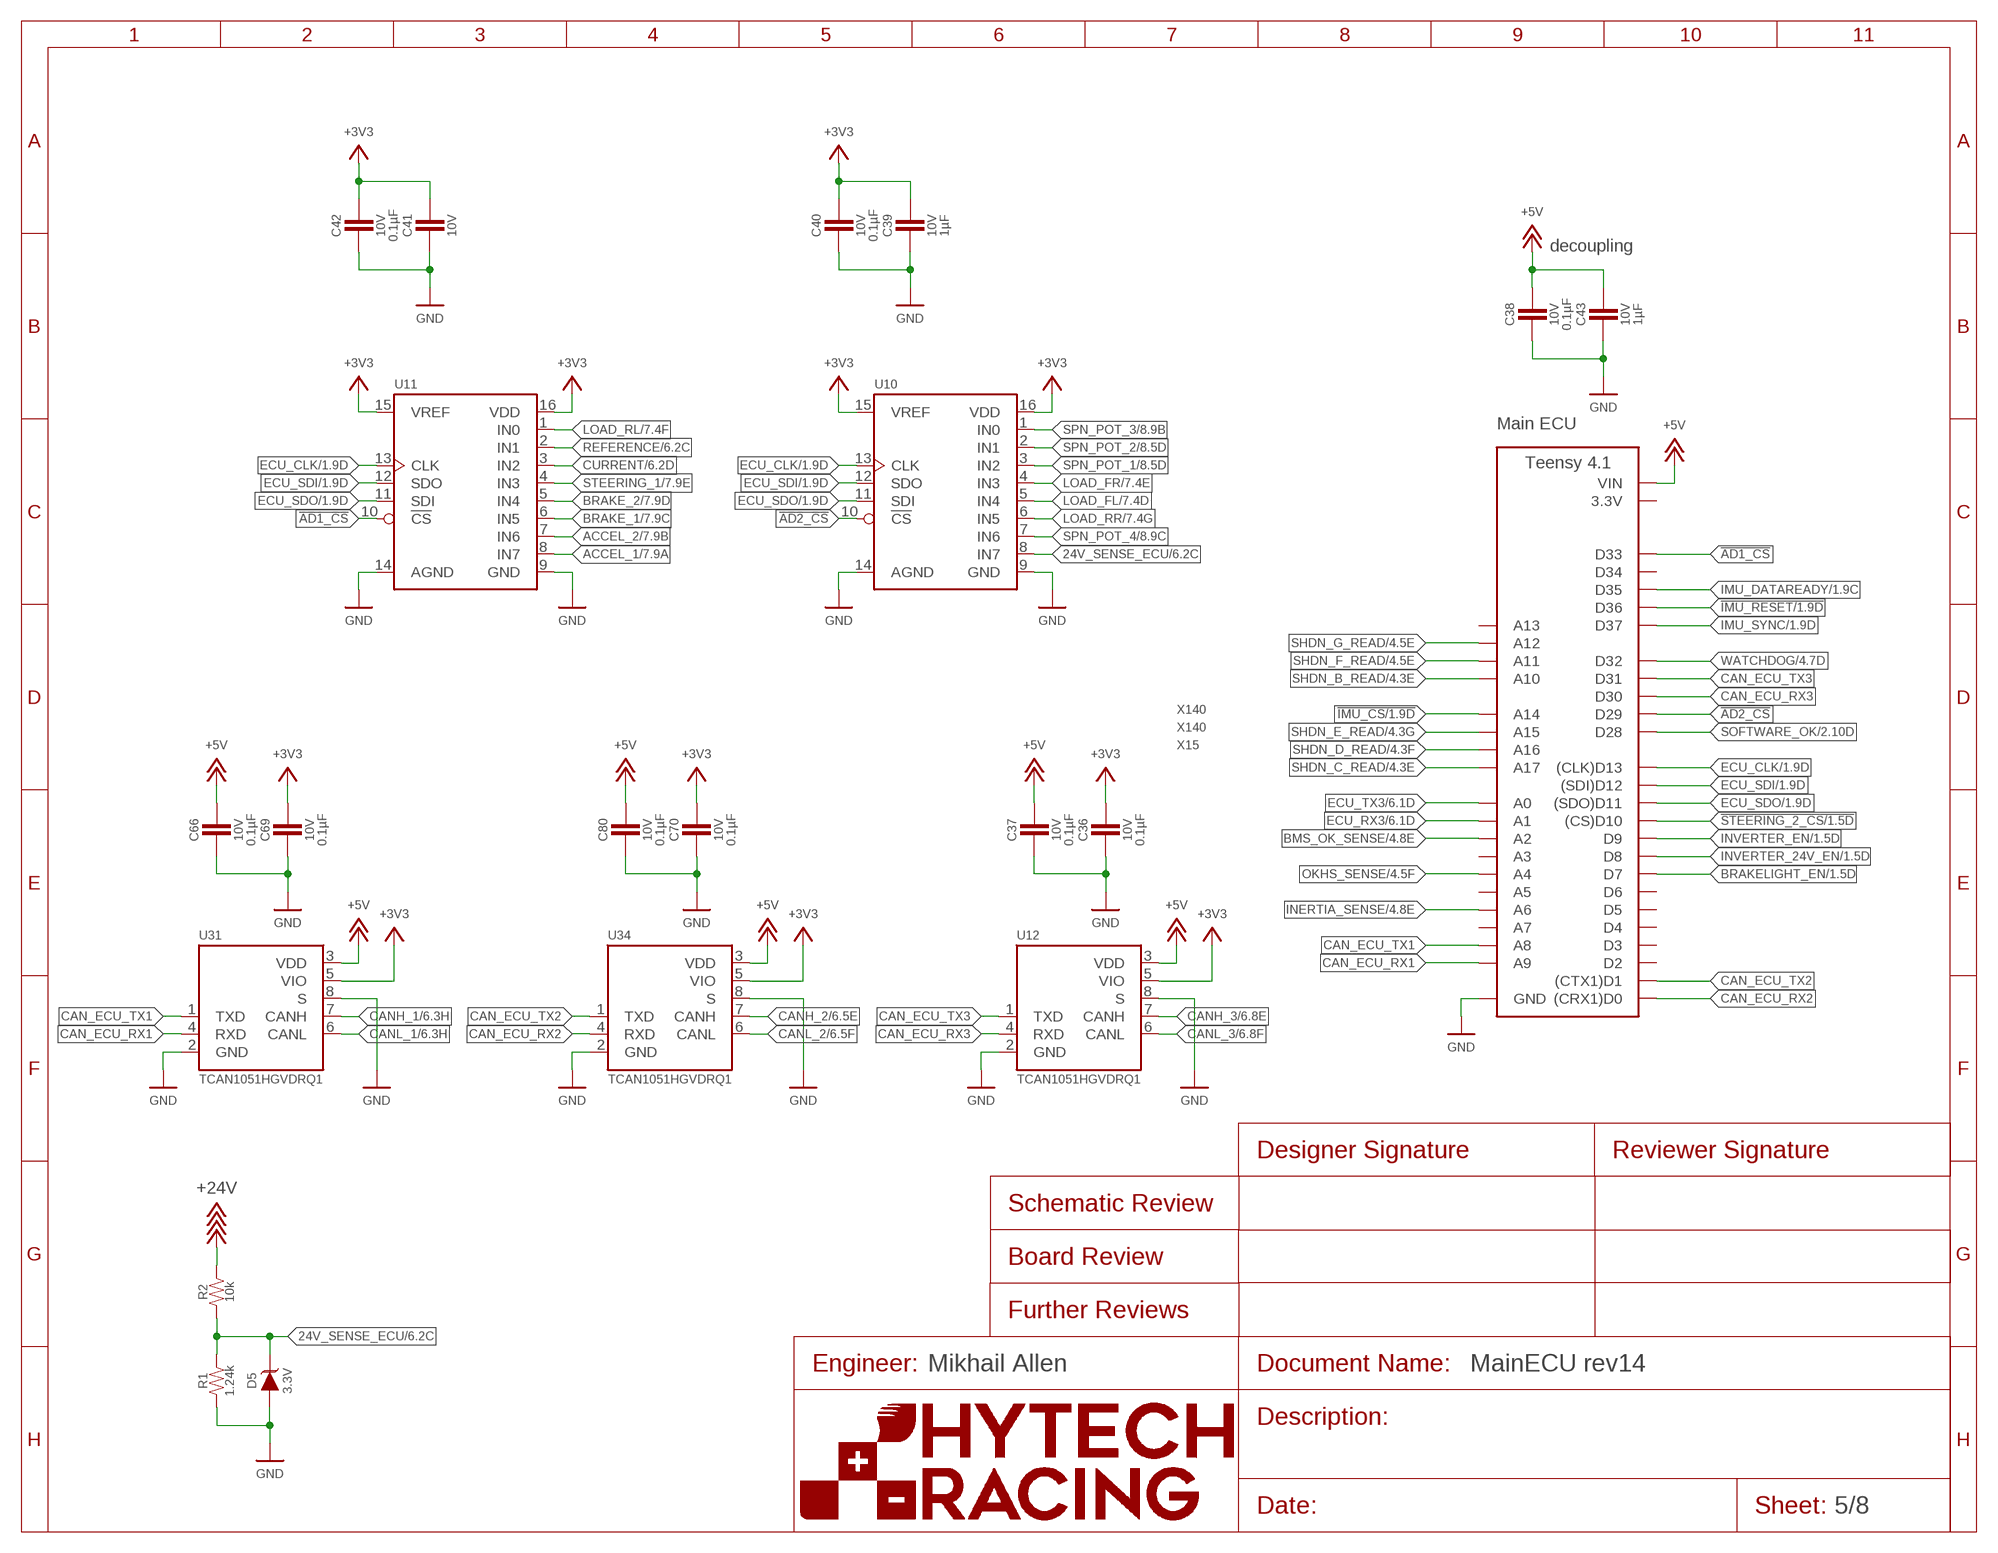
[diagram p4: schematic, sheet 5]
FRAME3 (FRAME): ENGINEER: Mikhail Allen

### Parts
A2  TEENSY_4.1_SMT  [TEENSY_LONG_SSM]
C36  CAPACITOR_0603_10V_0.1UF  [0603-CAP]
C37  CAPACITOR_0603_10V_0.1UF  [0603-CAP]
C38  CAPACITOR_0603_10V_0.1UF  [0603-CAP]
C39  CAPACITOR_0603_10V_1UF  [0603-CAP]
C40  CAPACITOR_0603_10V_0.1UF  [0603-CAP]
C41  CAPACITOR_0603_10V_1UF  [0603-CAP]
C42  CAPACITOR_0603_10V_0.1UF  [0603-CAP]
C43  CAPACITOR_0603_10V_1UF  [0603-CAP]
C66  CAPACITOR_0603_10V_0.1UF  [0603-CAP]
C69  CAPACITOR_0603_10V_0.1UF  [0603-CAP]
C70  CAPACITOR_0603_10V_0.1UF  [0603-CAP]
C80  CAPACITOR_0603_10V_0.1UF  [0603-CAP]
D5  TVS__5V  [SOT-23]
R1  RESISTOR_0603_1.24K  [0603-RES]
R2  RESISTOR_0603_10K  [0603-RES]
U10  MCP3208  [SOIC-16]
U11  MCP3208  [SOIC-16]
U12  TCAN1051HQV-Q1  [SOIC-08(NARROW,0.15")]
U31  TCAN1051HQV-Q1  [SOIC-08(NARROW,0.15")]
U34  TCAN1051HQV-Q1  [SOIC-08(NARROW,0.15")]

### Nets
24V_SENSE_ECU: D5.3(C) R1.2 R2.1 U10.8(IN7) ; also sheet 6
!AD1_CS: A2.D33 U11.10(!CS!)
!AD2_CS: A2.D29 U10.10(!CS!)
!IMU_CS: A2.D38(A14) ; also sheet 1
!IMU_RESET: A2.D36 ; also sheet 1
!STEERING_2_CS: A2.D10((CS)D10) ; also sheet 1
+3V3: C36.1 C39.1 C40.1 C41.1 C42.1 C69.1 C70.1 U10.15(VREF) U10.16(VDD) U11.15(VREF) U11.16(VDD) U12.5(VIO) U31.5(VIO) U34.5(VIO) ; also sheet 1,2,3,4,6
+5V: A2.VIN C37.1 C38.1 C43.1 C66.1 C80.1 U12.3(VDD) U31.3(VDD) U34.3(VDD) ; also sheet 1,2,3,6,7
+24V: R2.2 ; also sheet 1,2,3,4
ACCEL_1: U11.8(IN7) ; also sheet 7
ACCEL_2: U11.7(IN6) ; also sheet 7
BMS_OK_SENSE: A2.D16(A2) ; also sheet 4
BRAKE_1: U11.6(IN5) ; also sheet 3,7
BRAKE_2: U11.5(IN4) ; also sheet 7
BRAKELIGHT_EN: A2.D7 ; also sheet 1
CAN_ECU_RX1: A2.D23(A9) U31.4(RXD)
CAN_ECU_RX2: A2.D0((CRX1)D0) U34.4(RXD)
CAN_ECU_RX3: A2.D30 U12.4(RXD)
CAN_ECU_TX1: A2.D22(A8) U31.1(TXD)
CAN_ECU_TX2: A2.D1((CTX1)D1) U34.1(TXD)
CAN_ECU_TX3: A2.D31 U12.1(TXD)
CANH_1: U31.7(CANH) ; also sheet 1,2,6
CANH_2: U34.7(CANH) ; also sheet 1,2,6
CANH_3: U12.7(CANH) ; also sheet 1,2,6
CANL_1: U31.6(CANL) ; also sheet 1,2,6
CANL_2: U34.6(CANL) ; also sheet 1,2,6
CANL_3: U12.6(CANL) ; also sheet 1,2,6
CURRENT: U11.3(IN2) ; also sheet 3,6,7
ECU_CLK: A2.D13((CLK)D13) U10.13(CLK) U11.13(CLK) ; also sheet 1
ECU_RX3: A2.D15(A1) ; also sheet 6
ECU_SDI: A2.D12((SDI)D12) U10.12(SDO) U11.12(SDO) ; also sheet 1
ECU_SDO: A2.D11((SDO)D11) U10.11(SDI) U11.11(SDI) ; also sheet 1
ECU_TX3: A2.D14(A0) ; also sheet 6
GND: A2.AGND/GND(GND) A2.GND A2.GND@1(GND) C36.2 C37.2 C38.2 C39.2 C40.2 C41.2 C42.2 C43.2 C66.2 C69.2 C70.2 C80.2 D5.1(A) R1.1 U10.14(AGND) U11.14(AGND) U12.2(GND) U12.8(S) U31.2(GND) U31.8(S) U34.2(GND) U34.8(S) ; also sheet 1,2,3,4,6,7,8
IMU_DATAREADY: A2.D35 ; also sheet 1
IMU_SYNC: A2.D37 ; also sheet 1
INERTIA_SENSE: A2.D20(A6) ; also sheet 4
INVERTER_24V_EN: A2.D8 ; also sheet 1
INVERTER_EN: A2.D9 ; also sheet 1
LOAD_FL: U10.5(IN4) ; also sheet 7
LOAD_FR: U10.4(IN3) ; also sheet 7
LOAD_RL: U11.1(IN0) ; also sheet 7
LOAD_RR: U10.6(IN5) ; also sheet 7
N$10: U11.9(GND) ; supply symbol labelled GND
N$12: U10.9(GND) ; supply symbol labelled GND
OKHS_SENSE: A2.D18(A4) ; also sheet 4
REFERENCE: U11.2(IN1) ; also sheet 3,6,7
SHDN_B_READ: A2.D24(A10) ; also sheet 4
SHDN_C_READ: A2.D41(A17) ; also sheet 4
SHDN_D_READ: A2.D40(A16) ; also sheet 4
SHDN_E_READ: A2.D39(A15) ; also sheet 4
SHDN_F_READ: A2.D25(A11) ; also sheet 4
SHDN_G_READ: A2.D26(A12) ; also sheet 4
SOFTWARE_OK: A2.D28 ; also sheet 2,4
SPN_POT_1: U10.3(IN2) ; also sheet 8
SPN_POT_2: U10.2(IN1) ; also sheet 8
SPN_POT_3: U10.1(IN0) ; also sheet 8
SPN_POT_4: U10.7(IN6) ; also sheet 8
STEERING_1: U11.4(IN3) ; also sheet 7
WATCHDOG: A2.D32 ; also sheet 4
Unconnected: A2.D2 A2.D3 A2.D4 A2.D5 A2.D6 A2.D17(A3) A2.D19(A5) A2.D21(A7) A2.D27(A13) A2.D34

### Notes on the sheet
- decoupling
- Main ECU
- X140
- X140
- X15

## Sheet 6 of 8
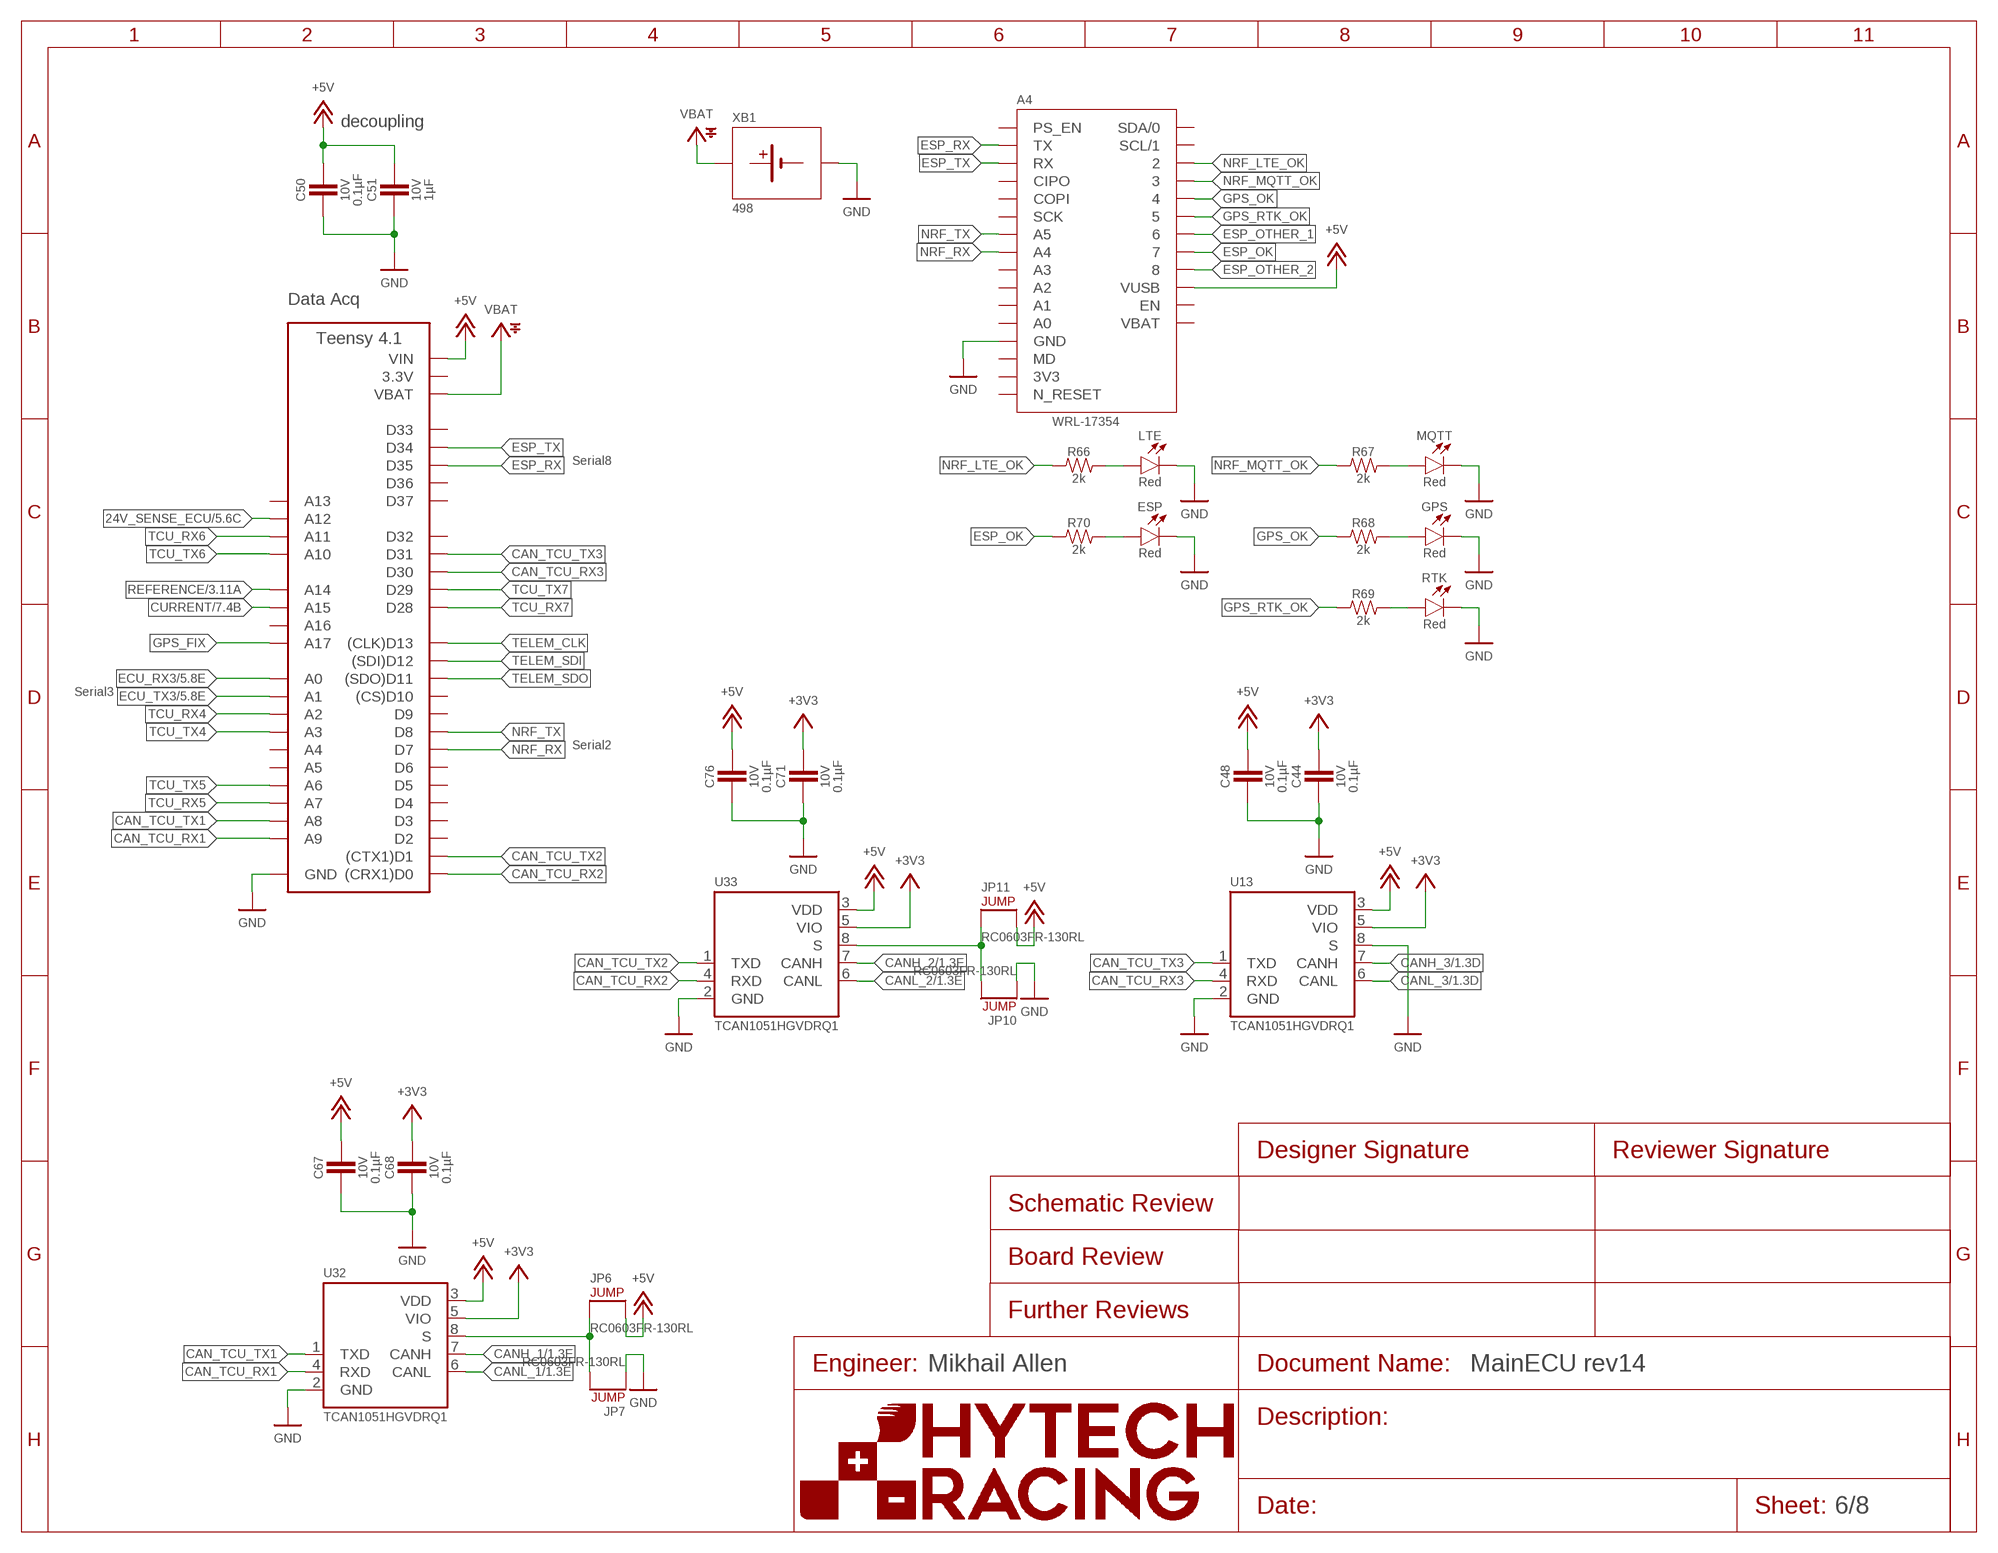
[diagram p5: schematic, sheet 6]
FRAME6 (FRAME): ENGINEER: Mikhail Allen

### Parts
A3  TEENSY_4.1  [TEENSY_LONG_EXT]
A4  NRF9160LTE  [NRF9160LTE]
C44  CAPACITOR_0603_10V_0.1UF  [0603-CAP]
C48  CAPACITOR_0603_10V_0.1UF  [0603-CAP]
C50  CAPACITOR_0603_10V_0.1UF  [0603-CAP]
C51  CAPACITOR_0603_10V_1UF  [0603-CAP]
C67  CAPACITOR_0603_10V_0.1UF  [0603-CAP]
C68  CAPACITOR_0603_10V_0.1UF  [0603-CAP]
C71  CAPACITOR_0603_10V_0.1UF  [0603-CAP]
C76  CAPACITOR_0603_10V_0.1UF  [0603-CAP]
ESP  LED_0603_RED  [0603-LED]
GPS  LED_0603_RED  [0603-LED]
JP6  JUMPER_0603_  [0603-RES]
JP7  DNP  JUMPER_0603_  [0603-RES]
JP10  DNP  JUMPER_0603_  [0603-RES]
JP11  JUMPER_0603_  [0603-RES]
LTE  LED_0603_RED  [0603-LED]
MQTT  LED_0603_RED  [0603-LED]
R66  RESISTOR_0603_2K  [0603-RES]
R67  RESISTOR_0603_2K  [0603-RES]
R68  RESISTOR_0603_2K  [0603-RES]
R69  RESISTOR_0603_2K  [0603-RES]
R70  RESISTOR_0603_2K  [0603-RES]
RTK  LED_0603_RED  [0603-LED]
U13  TCAN1051HQV-Q1  [SOIC-08(NARROW,0.15")]
U32  TCAN1051HQV-Q1  [SOIC-08(NARROW,0.15")]
U33  TCAN1051HQV-Q1  [SOIC-08(NARROW,0.15")]
XB1  BATTERY_HOLDER_KEYSTONE_498  [498]

### Nets
24V_SENSE_ECU: A3.D26(A12) ; also sheet 5
+3V3: C44.1 C68.1 C71.1 U13.5(VIO) U32.5(VIO) U33.5(VIO) ; also sheet 1,2,3,4,5
+5V: A3.VIN A4.VUSB C48.1 C50.1 C51.1 C67.1 C76.1 JP6.2 JP11.2 U13.3(VDD) U32.3(VDD) U33.3(VDD) ; also sheet 1,2,3,5,7
CAN_TCU_RX1: A3.D23(A9) U32.4(RXD)
CAN_TCU_RX2: A3.D0((CRX1)D0) U33.4(RXD)
CAN_TCU_RX3: A3.D30 U13.4(RXD)
CAN_TCU_TX1: A3.D22(A8) U32.1(TXD)
CAN_TCU_TX2: A3.D1((CTX1)D1) U33.1(TXD)
CAN_TCU_TX3: A3.D31 U13.1(TXD)
CANH_1: U32.7(CANH) ; also sheet 1,2,5
CANH_2: U33.7(CANH) ; also sheet 1,2,5
CANH_3: U13.7(CANH) ; also sheet 1,2,5
CANL_1: U32.6(CANL) ; also sheet 1,2,5
CANL_2: U33.6(CANL) ; also sheet 1,2,5
CANL_3: U13.6(CANL) ; also sheet 1,2,5
CURRENT: A3.D39(A15) ; also sheet 3,5,7
ECU_RX3: A3.D14(A0) ; also sheet 5
ECU_TX3: A3.D15(A1) ; also sheet 5
ESP_OK: A4.7 R70.1
ESP_OTHER_1: A4.6
ESP_OTHER_2: A4.8
ESP_RX: A3.D35 A4.TX
ESP_TX: A3.D34 A4.RX
GND: A3.AGND/GND(GND) A3.GND A3.GND@2(GND) A4.GND C44.2 C48.2 C50.2 C51.2 C67.2 C68.2 C71.2 C76.2 ESP.1(C) GPS.1(C) JP7.1 JP10.1 LTE.1(C) MQTT.1(C) RTK.1(C) U13.2(GND) U13.8(S) U32.2(GND) U33.2(GND) XB1.2(MINUS) ; also sheet 1,2,3,4,5,7,8
GPS_FIX: A3.D41(A17)
GPS_OK: A4.4 R68.1
GPS_RTK_OK: A4.5 R69.1
N$3: JP6.1 JP7.2 U32.8(S)
N$11: JP10.2 JP11.1 U33.8(S)
N$32: ESP.2(A) R70.2
N$35: LTE.2(A) R66.2
N$36: MQTT.2(A) R67.2
N$37: GPS.2(A) R68.2
N$38: R69.2 RTK.2(A)
NRF_LTE_OK: A4.2 R66.1
NRF_MQTT_OK: A4.3 R67.1
NRF_RX: A3.D7 A4.A4
NRF_TX: A3.D8 A4.A5
REFERENCE: A3.D38(A14) ; also sheet 3,5,7
TCU_RX4: A3.D16(A2)
TCU_RX5: A3.D21(A7)
TCU_RX6: A3.D25(A11)
TCU_RX7: A3.D28
TCU_TX4: A3.D17(A3)
TCU_TX5: A3.D20(A6)
TCU_TX6: A3.D24(A10)
TCU_TX7: A3.D29
TELEM_CLK: A3.D13((CLK)D13)
TELEM_SDI: A3.D12((SDI)D12)
TELEM_SDO: A3.D11((SDO)D11)
VBAT: A3.VBAT XB1.1(PLUS)
Unconnected: A3.D2 A3.D3 A3.D4 A3.D5 A3.D6 A3.D9 A3.D10((CS)D10) A3.D18(A4) A3.D19(A5) A3.D27(A13) A3.D32 A3.D33 A3.D36 A3.D37 A3.D40(A16) A4.A0 A4.A1 A4.A2 A4.A3 A4.CIPO A4.COPI A4.EN A4.MD A4.PS-EN(PS_EN) A4.RESET(N_RESET) A4.SCK A4.SCL/1 A4.SDA/0

### Notes on the sheet
- decoupling
- Data Acq
- Serial8
- Serial3
- Serial2

## Sheet 7 of 8
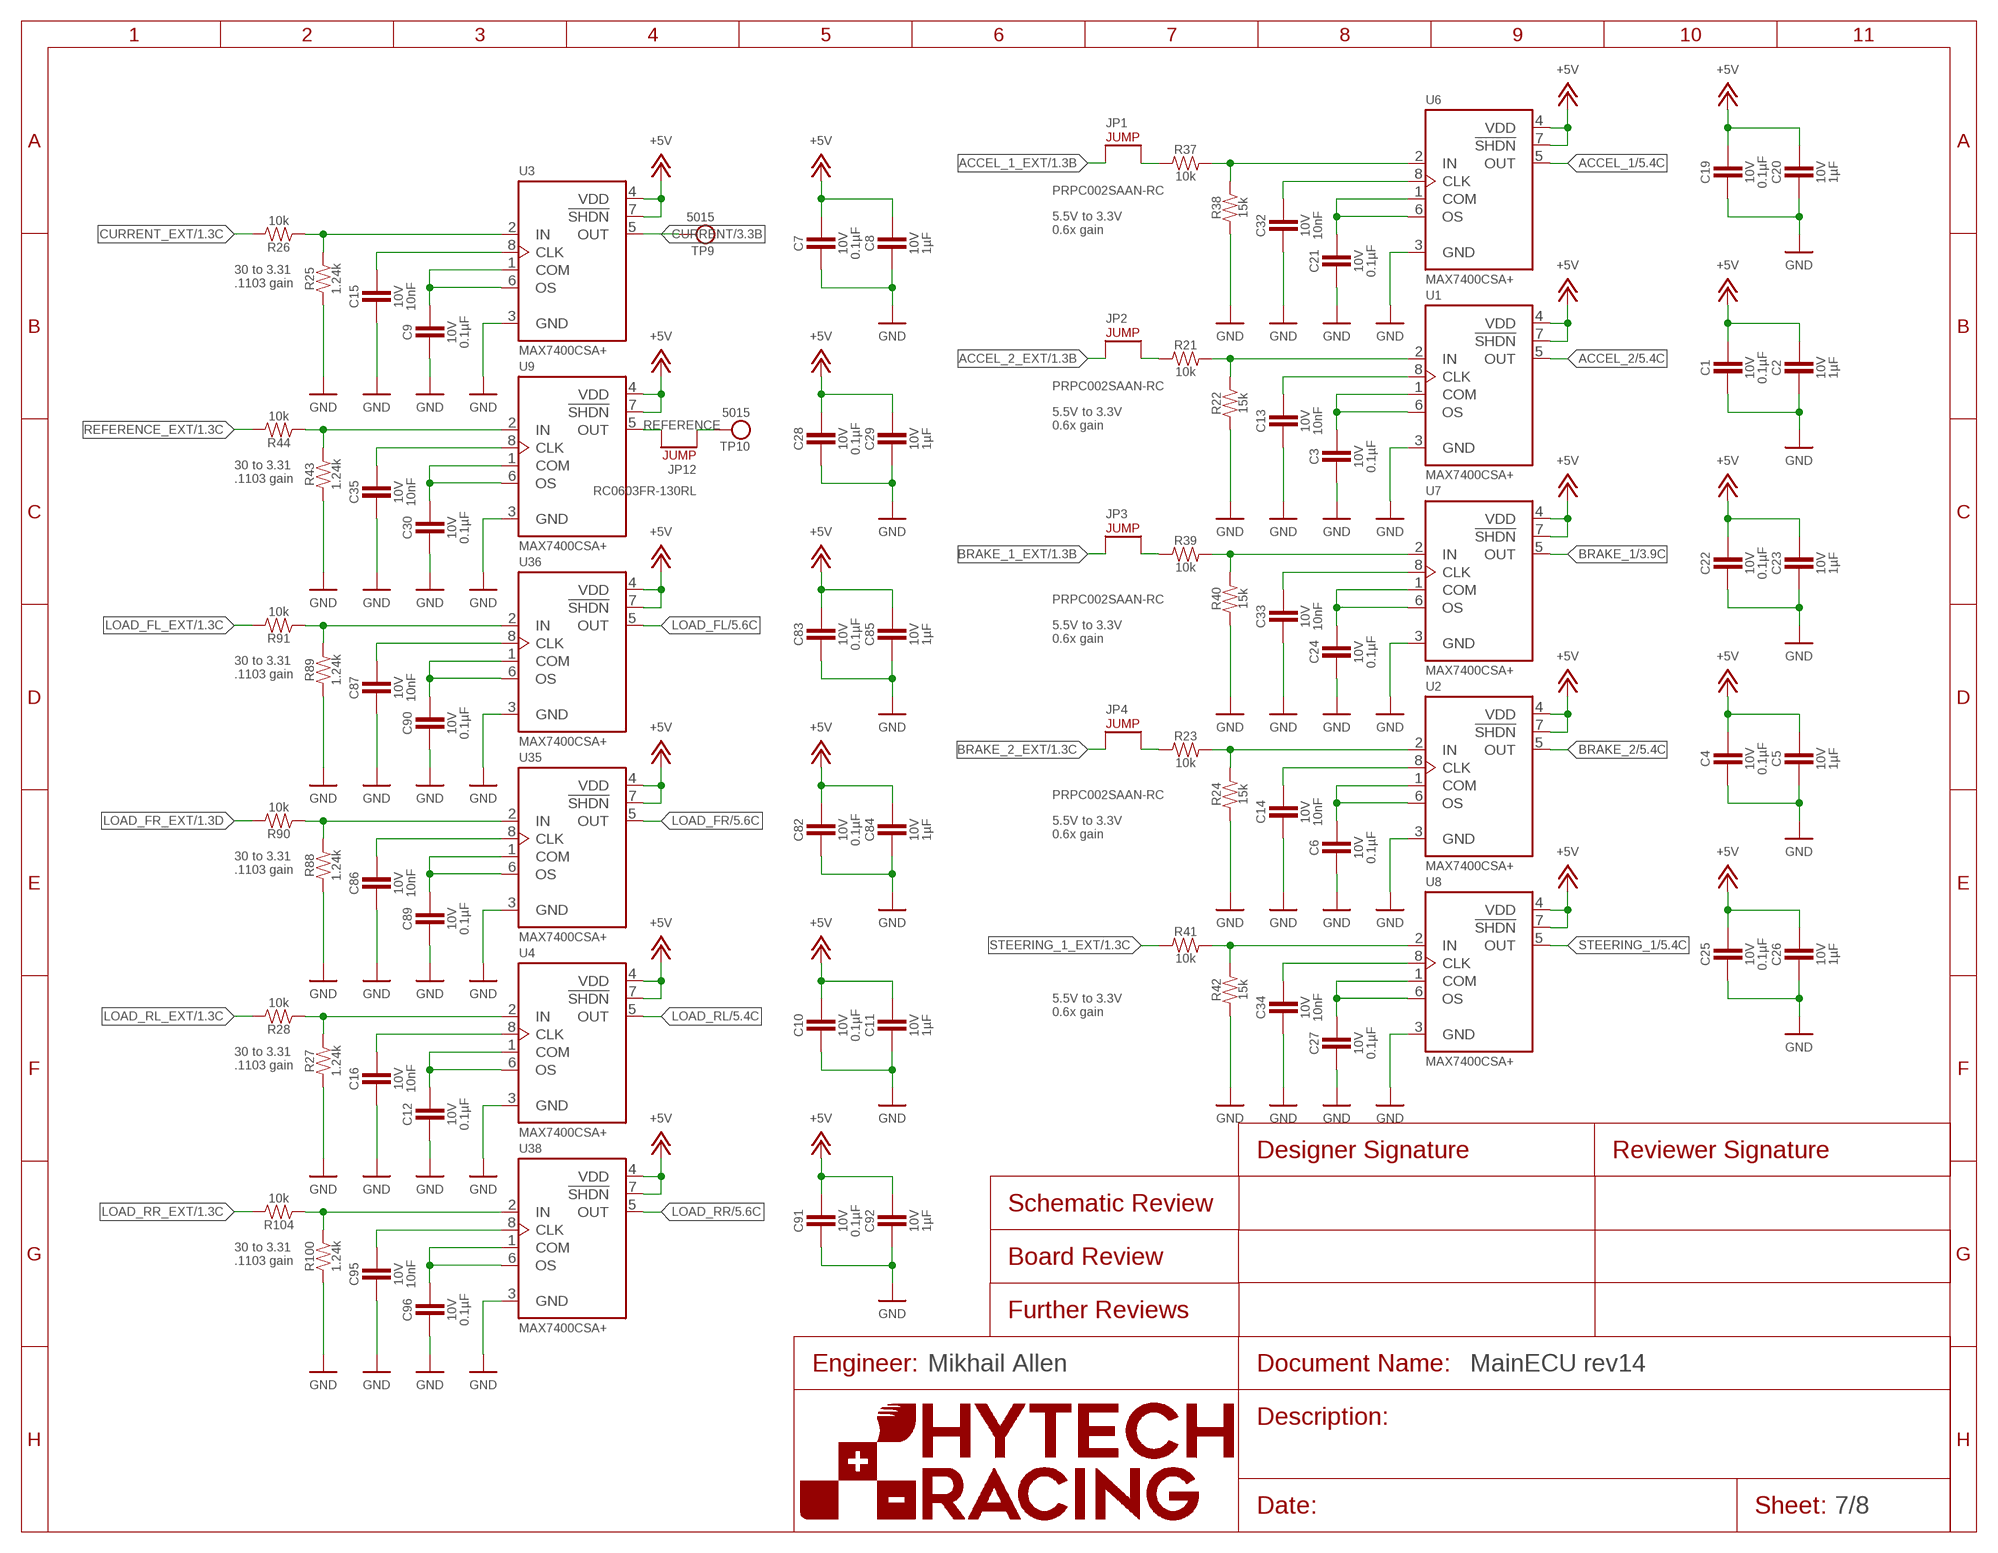
[diagram p6: schematic, sheet 7]
FRAME4 (FRAME): ENGINEER: Mikhail Allen

### Parts
C1  CAPACITOR_0603_10V_0.1UF  [0603-CAP]
C2  CAPACITOR_0603_10V_1UF  [0603-CAP]
C3  CAPACITOR_0603_10V_0.1UF  [0603-CAP]
C4  CAPACITOR_0603_10V_0.1UF  [0603-CAP]
C5  CAPACITOR_0603_10V_1UF  [0603-CAP]
C6  CAPACITOR_0603_10V_0.1UF  [0603-CAP]
C7  CAPACITOR_0603_10V_0.1UF  [0603-CAP]
C8  CAPACITOR_0603_10V_1UF  [0603-CAP]
C9  CAPACITOR_0603_10V_0.1UF  [0603-CAP]
C10  CAPACITOR_0603_10V_0.1UF  [0603-CAP]
C11  CAPACITOR_0603_10V_1UF  [0603-CAP]
C12  CAPACITOR_0603_10V_0.1UF  [0603-CAP]
C13  CAPACITOR_0603_10V_10NF  [0603-CAP]
C14  CAPACITOR_0603_10V_10NF  [0603-CAP]
C15  CAPACITOR_0603_10V_10NF  [0603-CAP]
C16  CAPACITOR_0603_10V_10NF  [0603-CAP]
C19  CAPACITOR_0603_10V_0.1UF  [0603-CAP]
C20  CAPACITOR_0603_10V_1UF  [0603-CAP]
C21  CAPACITOR_0603_10V_0.1UF  [0603-CAP]
C22  CAPACITOR_0603_10V_0.1UF  [0603-CAP]
C23  CAPACITOR_0603_10V_1UF  [0603-CAP]
C24  CAPACITOR_0603_10V_0.1UF  [0603-CAP]
C25  CAPACITOR_0603_10V_0.1UF  [0603-CAP]
C26  CAPACITOR_0603_10V_1UF  [0603-CAP]
C27  CAPACITOR_0603_10V_0.1UF  [0603-CAP]
C28  CAPACITOR_0603_10V_0.1UF  [0603-CAP]
C29  CAPACITOR_0603_10V_1UF  [0603-CAP]
C30  CAPACITOR_0603_10V_0.1UF  [0603-CAP]
C32  CAPACITOR_0603_10V_10NF  [0603-CAP]
C33  CAPACITOR_0603_10V_10NF  [0603-CAP]
C34  CAPACITOR_0603_10V_10NF  [0603-CAP]
C35  CAPACITOR_0603_10V_10NF  [0603-CAP]
C82  CAPACITOR_0603_10V_0.1UF  [0603-CAP]
C83  CAPACITOR_0603_10V_0.1UF  [0603-CAP]
C84  CAPACITOR_0603_10V_1UF  [0603-CAP]
C85  CAPACITOR_0603_10V_1UF  [0603-CAP]
C86  CAPACITOR_0603_10V_10NF  [0603-CAP]
C87  CAPACITOR_0603_10V_10NF  [0603-CAP]
C89  CAPACITOR_0603_10V_0.1UF  [0603-CAP]
C90  CAPACITOR_0603_10V_0.1UF  [0603-CAP]
C91  CAPACITOR_0603_10V_0.1UF  [0603-CAP]
C92  CAPACITOR_0603_10V_1UF  [0603-CAP]
C95  CAPACITOR_0603_10V_10NF  [0603-CAP]
C96  CAPACITOR_0603_10V_0.1UF  [0603-CAP]
JP1  JUMPER__1X02  [1X02]
JP2  JUMPER__1X02  [1X02]
JP3  JUMPER__1X02  [1X02]
JP4  JUMPER__1X02  [1X02]
JP12  JUMPER_0603_  [0603-RES]
R21  RESISTOR_0603_10K  [0603-RES]
R22  RESISTOR_0603_15K  [0603-RES]
R23  RESISTOR_0603_10K  [0603-RES]
R24  RESISTOR_0603_15K  [0603-RES]
R25  RESISTOR_0603_1.24K  [0603-RES]
R26  RESISTOR_0603_10K  [0603-RES]
R27  RESISTOR_0603_1.24K  [0603-RES]
R28  RESISTOR_0603_10K  [0603-RES]
R37  RESISTOR_0603_10K  [0603-RES]
R38  RESISTOR_0603_15K  [0603-RES]
R39  RESISTOR_0603_10K  [0603-RES]
R40  RESISTOR_0603_15K  [0603-RES]
R41  RESISTOR_0603_10K  [0603-RES]
R42  RESISTOR_0603_15K  [0603-RES]
R43  RESISTOR_0603_1.24K  [0603-RES]
R44  RESISTOR_0603_10K  [0603-RES]
R88  RESISTOR_0603_1.24K  [0603-RES]
R89  RESISTOR_0603_1.24K  [0603-RES]
R90  RESISTOR_0603_10K  [0603-RES]
R91  RESISTOR_0603_10K  [0603-RES]
R100  RESISTOR_0603_1.24K  [0603-RES]
R104  RESISTOR_0603_10K  [0603-RES]
TP9  TEST_POINT  [5015]
TP10  TEST_POINT  [5015]
U1  MAX7400  [SOIC-08(NARROW,0.15")]
U2  MAX7400  [SOIC-08(NARROW,0.15")]
U3  MAX7400  [SOIC-08(NARROW,0.15")]
U4  MAX7400  [SOIC-08(NARROW,0.15")]
U6  MAX7400  [SOIC-08(NARROW,0.15")]
U7  MAX7400  [SOIC-08(NARROW,0.15")]
U8  MAX7400  [SOIC-08(NARROW,0.15")]
U9  MAX7400  [SOIC-08(NARROW,0.15")]
U35  MAX7400  [SOIC-08(NARROW,0.15")]
U36  MAX7400  [SOIC-08(NARROW,0.15")]
U38  MAX7400  [SOIC-08(NARROW,0.15")]

### Nets
+5V: C1.1 C2.1 C4.1 C5.1 C7.1 C8.1 C10.1 C11.1 C19.1 C20.1 C22.1 C23.1 C25.1 C26.1 C28.1 C29.1 C82.1 C83.1 C84.1 C85.1 C91.1 C92.1 U1.4(VDD) U1.7(!SHDN) U2.4(VDD) U2.7(!SHDN) U3.4(VDD) U3.7(!SHDN) U4.4(VDD) U4.7(!SHDN) U6.4(VDD) U6.7(!SHDN) U7.4(VDD) U7.7(!SHDN) U8.4(VDD) U8.7(!SHDN) U9.4(VDD) U9.7(!SHDN) U35.4(VDD) U35.7(!SHDN) U36.4(VDD) U36.7(!SHDN) U38.4(VDD) U38.7(!SHDN) ; also sheet 1,2,3,5,6
ACCEL_1: U6.5(OUT) ; also sheet 5
ACCEL_1_EXT: JP1.1 ; also sheet 1
ACCEL_1_PRE: R37.2 R38.2 U6.2(IN)
ACCEL_2: U1.5(OUT) ; also sheet 5
ACCEL_2_EXT: JP2.1 ; also sheet 1
ACCEL_2_PRE: R21.2 R22.2 U1.2(IN)
BRAKE_1: U7.5(OUT) ; also sheet 3,5
BRAKE_1_EXT: JP3.1 ; also sheet 1
BRAKE_1_PRE: R39.2 R40.2 U7.2(IN)
BRAKE_2: U2.5(OUT) ; also sheet 5
BRAKE_2_EXT: JP4.1 ; also sheet 1
BRAKE_2_PRE: R23.2 R24.2 U2.2(IN)
CURRENT: TP9.1 U3.5(OUT) ; also sheet 3,5,6
CURRENT_EXT: R26.2 ; also sheet 1
GND: C1.2 C2.2 C3.2 C4.2 C5.2 C6.2 C7.2 C8.2 C9.2 C10.2 C11.2 C12.2 C13.2 C14.2 C15.2 C16.2 C19.2 C20.2 C21.2 C22.2 C23.2 C24.2 C25.2 C26.2 C27.2 C28.2 C29.2 C30.2 C32.2 C33.2 C34.2 C35.2 C82.2 C83.2 C84.2 C85.2 C86.2 C87.2 C89.2 C90.2 C91.2 C92.2 C95.2 C96.2 R22.1 R24.1 R25.1 R27.1 R38.1 R40.1 R42.1 R43.1 R88.1 R89.1 R100.1 U1.3(GND) U2.3(GND) U3.3(GND) U4.3(GND) U6.3(GND) U7.3(GND) U8.3(GND) U9.3(GND) U35.3(GND) U36.3(GND) U38.3(GND) ; also sheet 1,2,3,4,5,6,8
LOAD_FL: U36.5(OUT) ; also sheet 5
LOAD_FL_EXT: R91.2 ; also sheet 1
LOAD_FR: U35.5(OUT) ; also sheet 5
LOAD_FR_EXT: R90.2 ; also sheet 1
LOAD_RL: U4.5(OUT) ; also sheet 5
LOAD_RL_EXT: R28.2 ; also sheet 1
LOAD_RR: U38.5(OUT) ; also sheet 5
LOAD_RR_EXT: R104.2 ; also sheet 1
N$14: JP1.2 R37.1
N$27: JP2.2 R21.1
N$31: JP4.2 R23.1
N$33: JP3.2 R39.1
N$34: JP12.2 U9.5(OUT)
N$49: R25.2 R26.1 U3.2(IN)
N$50: C9.1 U3.1(COM) U3.6(OS)
N$51: C15.1 U3.8(CLK)
N$53: R43.2 R44.1 U9.2(IN)
N$54: C30.1 U9.1(COM) U9.6(OS)
N$55: C35.1 U9.8(CLK)
N$57: R89.2 R91.1 U36.2(IN)
N$63: C90.1 U36.1(COM) U36.6(OS)
N$64: C87.1 U36.8(CLK)
N$66: R88.2 R90.1 U35.2(IN)
N$69: C89.1 U35.1(COM) U35.6(OS)
N$70: C86.1 U35.8(CLK)
N$71: R27.2 R28.1 U4.2(IN)
N$72: C12.1 U4.1(COM) U4.6(OS)
N$77: C16.1 U4.8(CLK)
N$78: R100.2 R104.1 U38.2(IN)
N$79: C96.1 U38.1(COM) U38.6(OS)
N$80: C95.1 U38.8(CLK)
N$81: C27.1 U8.1(COM) U8.6(OS)
N$82: C21.1 U6.1(COM) U6.6(OS)
N$83: C32.1 U6.8(CLK)
N$84: C34.1 U8.8(CLK)
N$85: C3.1 U1.1(COM) U1.6(OS)
N$86: C13.1 U1.8(CLK)
N$88: C24.1 U7.1(COM) U7.6(OS)
N$89: C33.1 U7.8(CLK)
N$91: C6.1 U2.1(COM) U2.6(OS)
N$92: C14.1 U2.8(CLK)
REFERENCE: JP12.1 TP10.1 ; also sheet 3,5,6
REFERENCE_EXT: R44.2 ; also sheet 1
STEERING_1: U8.5(OUT) ; also sheet 5
STEERING_1_EXT: R41.1 ; also sheet 1
STEERING_1_PRE: R41.2 R42.2 U8.2(IN)

### Notes on the sheet
- 5.5V to 3.3V
  0.6x gain
- 30 to 3.31
  .1103 gain
- 5.5V to 3.3V
  0.6x gain
- 30 to 3.31
  .1103 gain
- 5.5V to 3.3V
  0.6x gain
- 30 to 3.31
  .1103 gain
- 5.5V to 3.3V
  0.6x gain
- 30 to 3.31
  .1103 gain
- 5.5V to 3.3V
  0.6x gain
- 30 to 3.31
  .1103 gain
- 30 to 3.31
  .1103 gain

## Sheet 8 of 8
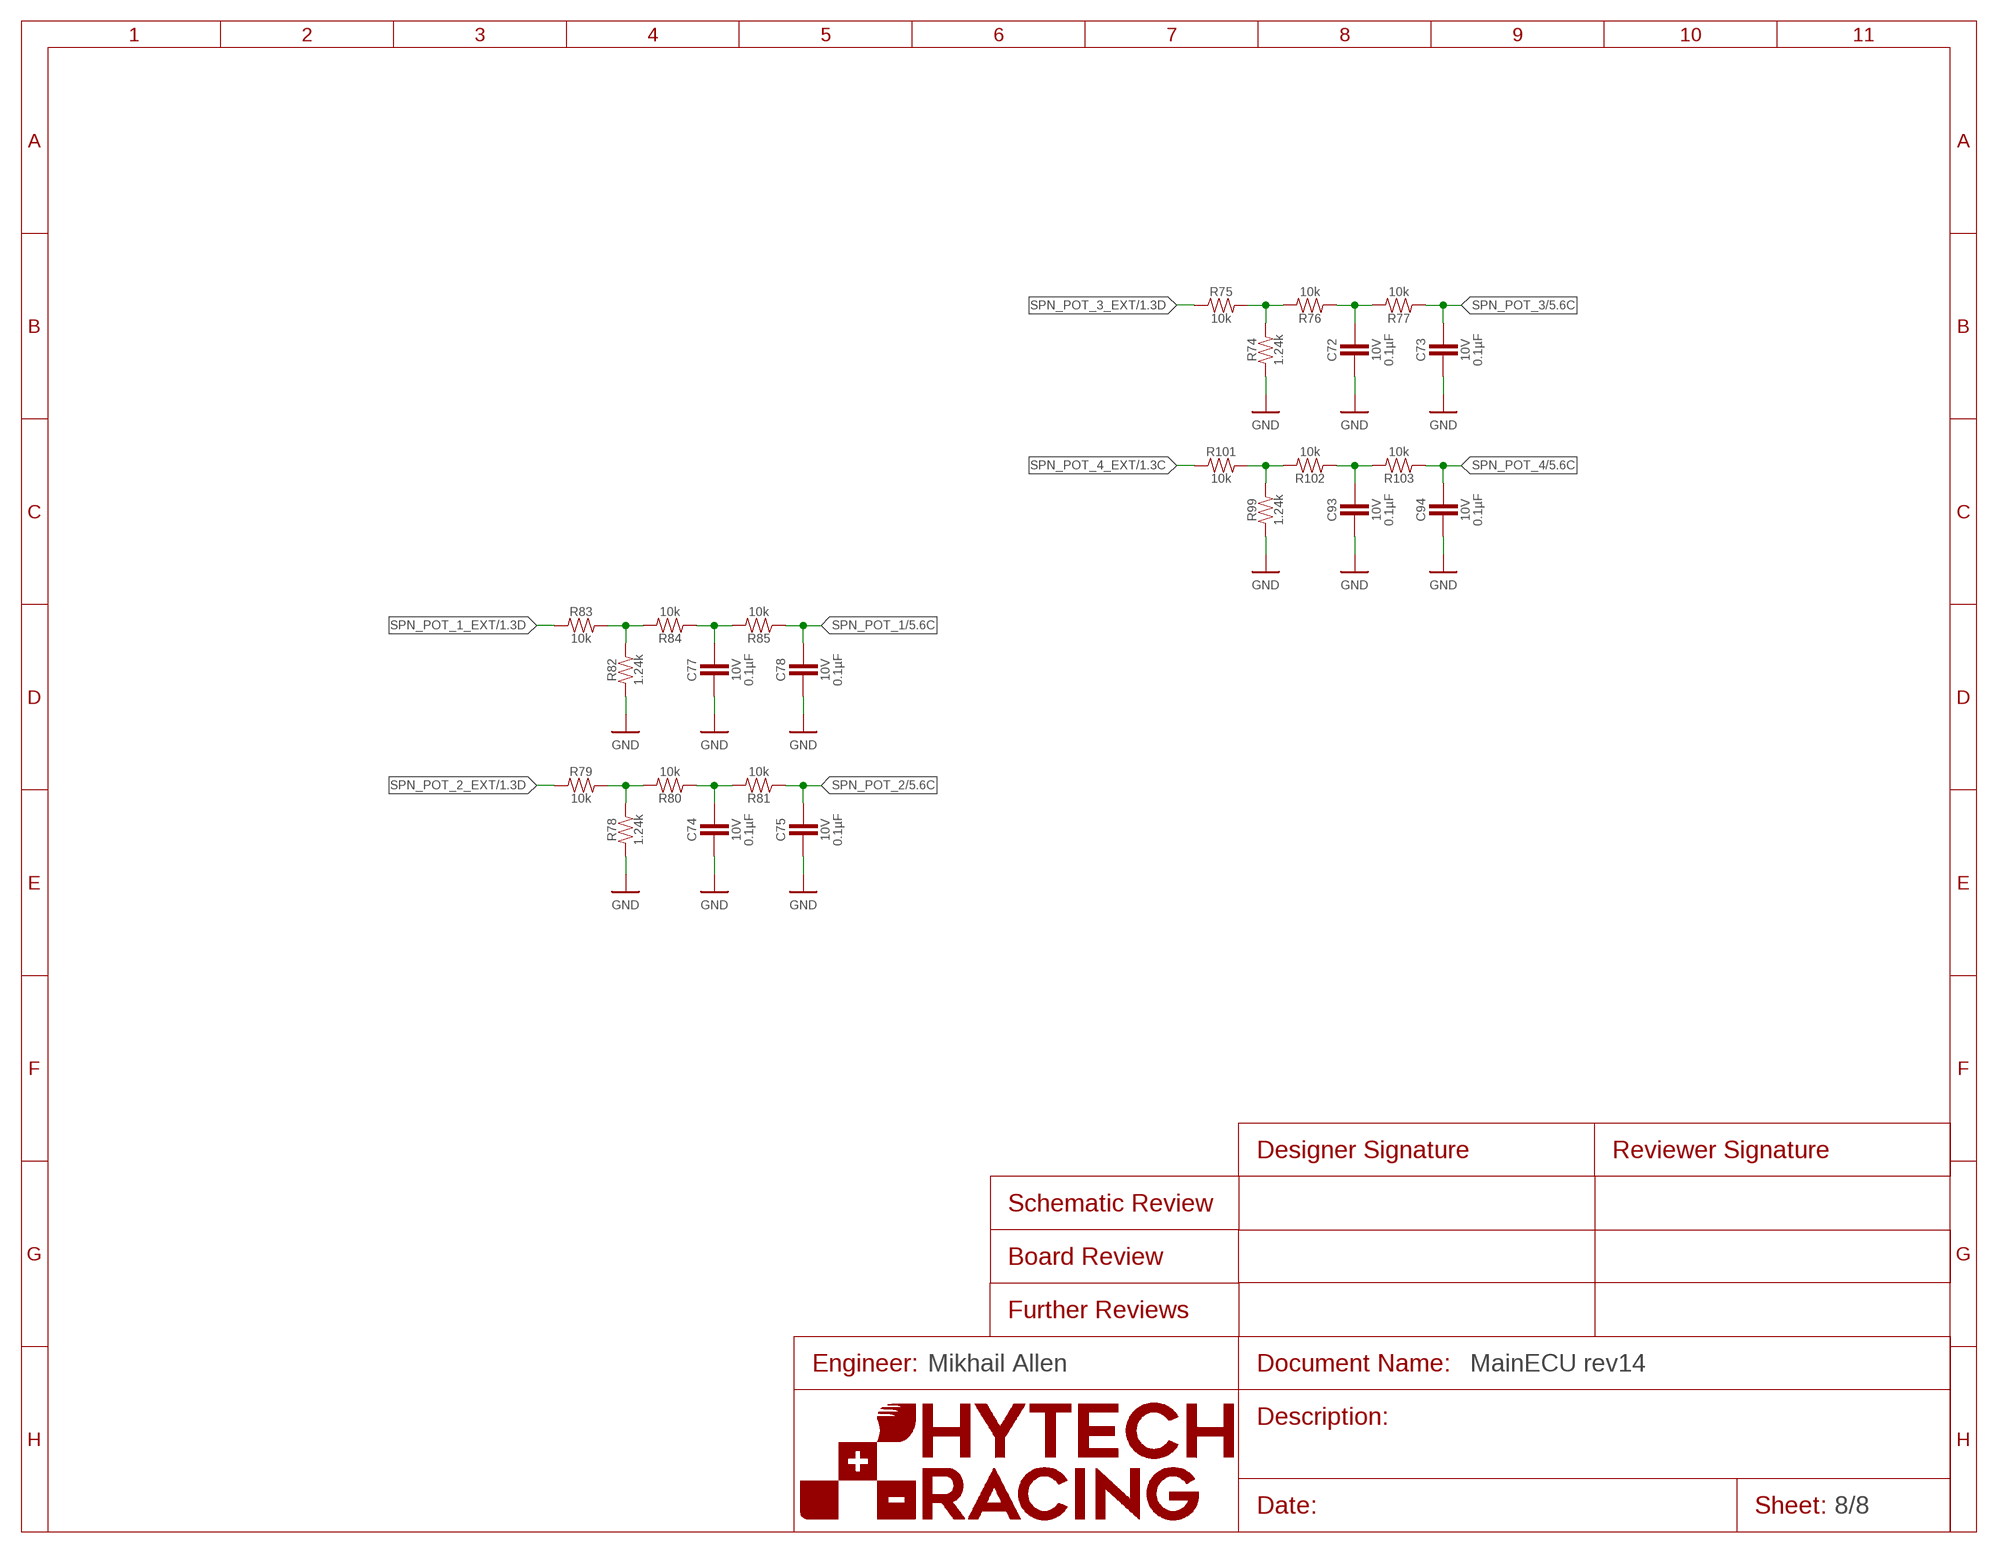
[diagram p7: schematic, sheet 8]
FRAME5 (FRAME): ENGINEER: Mikhail Allen

### Parts
C72  CAPACITOR_0603_10V_0.1UF  [0603-CAP]
C73  CAPACITOR_0603_10V_0.1UF  [0603-CAP]
C74  CAPACITOR_0603_10V_0.1UF  [0603-CAP]
C75  CAPACITOR_0603_10V_0.1UF  [0603-CAP]
C77  CAPACITOR_0603_10V_0.1UF  [0603-CAP]
C78  CAPACITOR_0603_10V_0.1UF  [0603-CAP]
C93  CAPACITOR_0603_10V_0.1UF  [0603-CAP]
C94  CAPACITOR_0603_10V_0.1UF  [0603-CAP]
R74  RESISTOR_0603_1.24K  [0603-RES]
R75  RESISTOR_0603_10K  [0603-RES]
R76  RESISTOR_0603_10K  [0603-RES]
R77  RESISTOR_0603_10K  [0603-RES]
R78  RESISTOR_0603_1.24K  [0603-RES]
R79  RESISTOR_0603_10K  [0603-RES]
R80  RESISTOR_0603_10K  [0603-RES]
R81  RESISTOR_0603_10K  [0603-RES]
R82  RESISTOR_0603_1.24K  [0603-RES]
R83  RESISTOR_0603_10K  [0603-RES]
R84  RESISTOR_0603_10K  [0603-RES]
R85  RESISTOR_0603_10K  [0603-RES]
R99  RESISTOR_0603_1.24K  [0603-RES]
R101  RESISTOR_0603_10K  [0603-RES]
R102  RESISTOR_0603_10K  [0603-RES]
R103  RESISTOR_0603_10K  [0603-RES]

### Nets
GND: C72.2 C73.2 C74.2 C75.2 C77.2 C78.2 C93.2 C94.2 R74.1 R78.1 R82.1 R99.1 ; also sheet 1,2,3,4,5,6,7
N$95: R82.2 R83.2 R84.2
N$96: C77.1 R84.1 R85.2
N$97: R78.2 R79.2 R80.2
N$98: C74.1 R80.1 R81.2
N$99: R74.2 R75.2 R76.2
N$100: C72.1 R76.1 R77.2
N$101: R99.2 R101.2 R102.2
N$102: C93.1 R102.1 R103.2
SPN_POT_1: C78.1 R85.1 ; also sheet 5
SPN_POT_1_EXT: R83.1 ; also sheet 1
SPN_POT_2: C75.1 R81.1 ; also sheet 5
SPN_POT_2_EXT: R79.1 ; also sheet 1
SPN_POT_3: C73.1 R77.1 ; also sheet 5
SPN_POT_3_EXT: R75.1 ; also sheet 1
SPN_POT_4: C94.1 R103.1 ; also sheet 5
SPN_POT_4_EXT: R101.1 ; also sheet 1

## Power pins joined to a net without a drawn wire
3.3V: A2.3.3V A2.3.3V@1(3.3V) A3.3V3(3.3V) A3.3V3@2(3.3V) A3.3V3@3(3.3V)
3V3: A4.3V3
VBAT: A4.VBAT

## Library data of the parts
3V3 5V0 = HyTechDevices:LED_?_*: LED 0603 Blue <https://www.mouser.com/datasheet/2/216/APT1608VBC_D-246010.pdf> Green <https://www.mouser.com/datasheet/2/216/APT1608ZGCK-1173388.pdf> Orange <https://www.mouser.com/datasheet/2/216/APT1608SECK-6197.pdf> Red <https://www.mouser.com/datasheet/2/216/APT1608SECK-J3-PRV-1173336.pdf> White <https://www.mouser.com/datasheet/2/50/SM0603UWC-880813.pdf> Yellow <https://www.mouser.com/datasheet/2/216/APT1608SYCK-J3-PRV-1173311.pdf> 2835 (Series not on Digikey) Lumiled LUXEON 2835 Color Line <https://www.mouser.com/datasheet/2/602/DS236_luxeon_2835_color_line_datasheet-1596094.pdf>; COLOR: Yellow; DKPN: 754-1788-1-ND; MANUFACTURER: Kingbright; MOPN: 604-APT1608SYCK/J3-PRV; MPN: APT1608SYCK/J3-PRV
A1 = HyTechDevices:VOLTAGE_REGULATOR_MODULE_?_*: Voltage Regulator Modules OKI-78SR Datasheet <https://www.mouser.com/datasheet/2/281/oki-78sr-56393.pdf>; DKPN: 811-2196-5-ND; MANUFACTURER: Murata Power Solutions Inc.; MOPN: 580-OKI78SR5/1.5W36C; MPN: OKI-78SR-5/1.5-W36-C
A2 = HyTechDevices:TEENSY_4.1_SMT: Teensy 4.1 without VBAT Datasheet <https://www.pjrc.com/store/teensy41.html#pins> Requires ordering of: 2: 24 pin, 0.1" pitch SMT female headers; TEENSY: 4.1
A3 = HyTechDevices:TEENSY_4.1: Teensy 4.1 with VBAT Datasheet <https://www.pjrc.com/store/teensy41.html#pins> Requires ordering of: 2: 24 pin, 0.1" pitch female headers 1: 2 pin, 0.1" pitch female headers; TEENSY: 4.1
A4 = HyTechDevices:NRF9160LTE: SparkFun Thing Plus - nRF9160 LTE module Datasheet <https://cdn.sparkfun.com/assets/learn_tutorials/1/5/9/7/nRF9160_PS_v1.2.pdf> Sparkfun link <https://www.sparkfun.com/products/17354>; DKPN: 1568-WRL-17354-ND; MANUFACTURER: SparkFun Electronics; MOPN: 474-WRL-17354; MPN: WRL-17354
B BSPD C D E F G = HyTechDevices:LED_?_*: LED 0603 Blue <https://www.mouser.com/datasheet/2/216/APT1608VBC_D-246010.pdf> Green <https://www.mouser.com/datasheet/2/216/APT1608ZGCK-1173388.pdf> Orange <https://www.mouser.com/datasheet/2/216/APT1608SECK-6197.pdf> Red <https://www.mouser.com/datasheet/2/216/APT1608SECK-J3-PRV-1173336.pdf> White <https://www.mouser.com/datasheet/2/50/SM0603UWC-880813.pdf> Yellow <https://www.mouser.com/datasheet/2/216/APT1608SYCK-J3-PRV-1173311.pdf> 2835 (Series not on Digikey) Lumiled LUXEON 2835 Color Line <https://www.mouser.com/datasheet/2/602/DS236_luxeon_2835_color_line_datasheet-1596094.pdf>; COLOR: Green; DKPN: 754-1790-1-ND; MANUFACTURER: Kingbright; MOPN: 604-APT1608ZGCK; MPN: APT1608ZGCK
B_HI B_MIS C_HI C_MIS ESP GPS LTE MQTT RTK = HyTechDevices:LED_?_*: LED 0603 Blue <https://www.mouser.com/datasheet/2/216/APT1608VBC_D-246010.pdf> Green <https://www.mouser.com/datasheet/2/216/APT1608ZGCK-1173388.pdf> Orange <https://www.mouser.com/datasheet/2/216/APT1608SECK-6197.pdf> Red <https://www.mouser.com/datasheet/2/216/APT1608SECK-J3-PRV-1173336.pdf> White <https://www.mouser.com/datasheet/2/50/SM0603UWC-880813.pdf> Yellow <https://www.mouser.com/datasheet/2/216/APT1608SYCK-J3-PRV-1173311.pdf> 2835 (Series not on Digikey) Lumiled LUXEON 2835 Color Line <https://www.mouser.com/datasheet/2/602/DS236_luxeon_2835_color_line_datasheet-1596094.pdf>; COLOR: Red; DKPN: 754-1786-1-ND; MANUFACTURER: Kingbright; MOPN: 604-APT1608SECKJ3PRV; MPN: APT1608SECK/J3-PRV
BMS IMD SWOK WDOG = HyTechDevices:LED_?_*: LED 0603 Blue <https://www.mouser.com/datasheet/2/216/APT1608VBC_D-246010.pdf> Green <https://www.mouser.com/datasheet/2/216/APT1608ZGCK-1173388.pdf> Orange <https://www.mouser.com/datasheet/2/216/APT1608SECK-6197.pdf> Red <https://www.mouser.com/datasheet/2/216/APT1608SECK-J3-PRV-1173336.pdf> White <https://www.mouser.com/datasheet/2/50/SM0603UWC-880813.pdf> Yellow <https://www.mouser.com/datasheet/2/216/APT1608SYCK-J3-PRV-1173311.pdf> 2835 (Series not on Digikey) Lumiled LUXEON 2835 Color Line <https://www.mouser.com/datasheet/2/602/DS236_luxeon_2835_color_line_datasheet-1596094.pdf>; COLOR: Orange; DKPN: 754-1120-1-ND; MANUFACTURER: Kingbright; MOPN: 604-APT1608SECK; MPN: APT1608SECK
C1 C3 C4 C6 C7 C9 C10 C12 C19 C21 C22 C24 C25 C27 C28 C30 C36-C38 C40 C42 C44 C45 C48 C50 C53-C59 C61 C64 C66-C78 C80 C82 C83 C89-C91 C93 C94 C96 = HyTechDevices:CAPACITOR_?_*: Capacitor, Non-Polarized VJ...1BC Series Datasheet <https://www.mouser.com/datasheet/2/427/vjw1bcbascomseries-1762447.pdf> Samsung Datasheet <https://www.mouser.com/datasheet/2/585/MLCC-1837944.pdf> Walsin Datasheet <https://www.mouser.com/datasheet/2/210/WTC_MLCC_General_Purpose-1534899.pdf> GRM188R61A226ME15D <https://www.mouser.com/datasheet/2/281/1/GRM188R61A226ME15_02A-1985787.pdf> GRM188R61E106MA73D <https://www.mouser.com/datasheet/2/281/1/GRM188R61E106MA73_01A-1985806.pdf> 885012006013 <https://www.mouser.com/datasheet/2/445/885012006013-1726946.pdf> 2220Y6300105KXTWS2 <https://www.mouser.com/datasheet/2/218/SMD_High_and_Std_StackiCap_P62-1825512.pdf> Yageo Class 2, X5R <https://www.mouser.com/datasheet/2/447/UPY_GPHC_X5R_4V_to_50V_26-1827097.pdf> TDK C Series <https://www.mouser.com/ProductDetail/TDK/C3216X5R1V226M160AC?qs=%2Fha2pyFadujbcx9jh7lYl%2F4NeMoXFhdc8AqVWNq4wW6M2y7zl6GzBuhgtI0ngznN> AVX Automotive MLCC <https://www.mouser.com/datasheet/2/40/AutoMLCC-777028.pdf> KEMET X7R Series <https://www.mouser.com/datasheet/2/212/KEM_C1002_X7R_SMD-1102033.pdf> Kyocera AVX <https://www.mouser.com/datasheet/2/40/C0GNP0_Dielectric-951274.pdf> GRM21BR61H <https://www.mouser.com/datasheet/2/281/1/GRM21BR61H106KE43_01A-1986884.pdf> C1812W104KDRACTU <https://www.mouser.com/datasheet/2/212/KEM_C1034_X7R_HV_ARC_SMD-1101730.pdf>; CAPACITANCE: 0.1µF; DKPN: 720-1688-1-ND; MANUFACTURER: Vishay Vitramon; MOPN: 77-VJ0603Y104JXQPBC; MPN: VJ0603Y104JXQPW1BC; TOLERANCE: 5%; VOLTAGE: 10V
C2 C5 C8 C11 C20 C23 C26 C29 C39 C41 C43 C46 C51 C84 C85 C92 = HyTechDevices:CAPACITOR_?_*: Capacitor, Non-Polarized VJ...1BC Series Datasheet <https://www.mouser.com/datasheet/2/427/vjw1bcbascomseries-1762447.pdf> Samsung Datasheet <https://www.mouser.com/datasheet/2/585/MLCC-1837944.pdf> Walsin Datasheet <https://www.mouser.com/datasheet/2/210/WTC_MLCC_General_Purpose-1534899.pdf> GRM188R61A226ME15D <https://www.mouser.com/datasheet/2/281/1/GRM188R61A226ME15_02A-1985787.pdf> GRM188R61E106MA73D <https://www.mouser.com/datasheet/2/281/1/GRM188R61E106MA73_01A-1985806.pdf> 885012006013 <https://www.mouser.com/datasheet/2/445/885012006013-1726946.pdf> 2220Y6300105KXTWS2 <https://www.mouser.com/datasheet/2/218/SMD_High_and_Std_StackiCap_P62-1825512.pdf> Yageo Class 2, X5R <https://www.mouser.com/datasheet/2/447/UPY_GPHC_X5R_4V_to_50V_26-1827097.pdf> TDK C Series <https://www.mouser.com/ProductDetail/TDK/C3216X5R1V226M160AC?qs=%2Fha2pyFadujbcx9jh7lYl%2F4NeMoXFhdc8AqVWNq4wW6M2y7zl6GzBuhgtI0ngznN> AVX Automotive MLCC <https://www.mouser.com/datasheet/2/40/AutoMLCC-777028.pdf> KEMET X7R Series <https://www.mouser.com/datasheet/2/212/KEM_C1002_X7R_SMD-1102033.pdf> Kyocera AVX <https://www.mouser.com/datasheet/2/40/C0GNP0_Dielectric-951274.pdf> GRM21BR61H <https://www.mouser.com/datasheet/2/281/1/GRM21BR61H106KE43_01A-1986884.pdf> C1812W104KDRACTU <https://www.mouser.com/datasheet/2/212/KEM_C1034_X7R_HV_ARC_SMD-1101730.pdf>; CAPACITANCE: 1µF; DKPN: 311-1796-1-ND; MANUFACTURER: Yageo; MOPN: 603-CC603KRX7R6BB105; MPN: CC0603KRX7R6BB105; TOLERANCE: 10%; VOLTAGE: 10V
C13-C16 C32-C35 C86 C87 C95 = HyTechDevices:CAPACITOR_?_*: Capacitor, Non-Polarized VJ...1BC Series Datasheet <https://www.mouser.com/datasheet/2/427/vjw1bcbascomseries-1762447.pdf> Samsung Datasheet <https://www.mouser.com/datasheet/2/585/MLCC-1837944.pdf> Walsin Datasheet <https://www.mouser.com/datasheet/2/210/WTC_MLCC_General_Purpose-1534899.pdf> GRM188R61A226ME15D <https://www.mouser.com/datasheet/2/281/1/GRM188R61A226ME15_02A-1985787.pdf> GRM188R61E106MA73D <https://www.mouser.com/datasheet/2/281/1/GRM188R61E106MA73_01A-1985806.pdf> 885012006013 <https://www.mouser.com/datasheet/2/445/885012006013-1726946.pdf> 2220Y6300105KXTWS2 <https://www.mouser.com/datasheet/2/218/SMD_High_and_Std_StackiCap_P62-1825512.pdf> Yageo Class 2, X5R <https://www.mouser.com/datasheet/2/447/UPY_GPHC_X5R_4V_to_50V_26-1827097.pdf> TDK C Series <https://www.mouser.com/ProductDetail/TDK/C3216X5R1V226M160AC?qs=%2Fha2pyFadujbcx9jh7lYl%2F4NeMoXFhdc8AqVWNq4wW6M2y7zl6GzBuhgtI0ngznN> AVX Automotive MLCC <https://www.mouser.com/datasheet/2/40/AutoMLCC-777028.pdf> KEMET X7R Series <https://www.mouser.com/datasheet/2/212/KEM_C1002_X7R_SMD-1102033.pdf> Kyocera AVX <https://www.mouser.com/datasheet/2/40/C0GNP0_Dielectric-951274.pdf> GRM21BR61H <https://www.mouser.com/datasheet/2/281/1/GRM21BR61H106KE43_01A-1986884.pdf> C1812W104KDRACTU <https://www.mouser.com/datasheet/2/212/KEM_C1034_X7R_HV_ARC_SMD-1101730.pdf>; CAPACITANCE: 10nF; DKPN: 311-4054-1-ND; MANUFACTURER: Yageo; MOPN: 603-CC603KRX7R6BB103; MPN: CC0603KRX7R6BB103; TOLERANCE: 10%; VOLTAGE: 10V
C17 C31 C63 C81 = HyTechDevices:CAPACITOR_?_*: Capacitor, Non-Polarized VJ...1BC Series Datasheet <https://www.mouser.com/datasheet/2/427/vjw1bcbascomseries-1762447.pdf> Samsung Datasheet <https://www.mouser.com/datasheet/2/585/MLCC-1837944.pdf> Walsin Datasheet <https://www.mouser.com/datasheet/2/210/WTC_MLCC_General_Purpose-1534899.pdf> GRM188R61A226ME15D <https://www.mouser.com/datasheet/2/281/1/GRM188R61A226ME15_02A-1985787.pdf> GRM188R61E106MA73D <https://www.mouser.com/datasheet/2/281/1/GRM188R61E106MA73_01A-1985806.pdf> 885012006013 <https://www.mouser.com/datasheet/2/445/885012006013-1726946.pdf> 2220Y6300105KXTWS2 <https://www.mouser.com/datasheet/2/218/SMD_High_and_Std_StackiCap_P62-1825512.pdf> Yageo Class 2, X5R <https://www.mouser.com/datasheet/2/447/UPY_GPHC_X5R_4V_to_50V_26-1827097.pdf> TDK C Series <https://www.mouser.com/ProductDetail/TDK/C3216X5R1V226M160AC?qs=%2Fha2pyFadujbcx9jh7lYl%2F4NeMoXFhdc8AqVWNq4wW6M2y7zl6GzBuhgtI0ngznN> AVX Automotive MLCC <https://www.mouser.com/datasheet/2/40/AutoMLCC-777028.pdf> KEMET X7R Series <https://www.mouser.com/datasheet/2/212/KEM_C1002_X7R_SMD-1102033.pdf> Kyocera AVX <https://www.mouser.com/datasheet/2/40/C0GNP0_Dielectric-951274.pdf> GRM21BR61H <https://www.mouser.com/datasheet/2/281/1/GRM21BR61H106KE43_01A-1986884.pdf> C1812W104KDRACTU <https://www.mouser.com/datasheet/2/212/KEM_C1034_X7R_HV_ARC_SMD-1101730.pdf>; CAPACITANCE: 10µF; DKPN: 490-7202-1-ND; MANUFACTURER: Murata Electronics; MOPN: 81-GRM188R61E106MA3D; MPN: GRM188R61E106MA73D; TOLERANCE: 20%; VOLTAGE: 25V
C18 = HyTechDevices:CAPACITOR_ELECTROLYTIC_?_*: A759 Series Aluminium Hybrid Electrolytic Capacitor Datasheet <https://www.mouser.com/datasheet/2/212/KEM_A4072_A759-1104329.pdf> EEH_AZS Hybrid Electrolytic Capacitor Datasheet <https://www.mouser.com/datasheet/2/315/DMD0000COL92-1141863.pdf> EEU-FP1E Aluminum Electrolytic Capacitor Datasheet <https://www.mouser.com/datasheet/2/315/RDF0000C1260-1391675.pdf>; CAPACITANCE: 470uF; DKPN: 10-EEH-AZS1V471BCT-ND; MANUFACTURER: Panasonic Electronic Components; MOPN: 667-EEH-AZS1V471B; MPN: EEH-AZS1V471B; TOLERANCE: 20&; VOLTAGE: 35V
C52 C65 C79 = HyTechDevices:CAPACITOR_?_*: Capacitor, Non-Polarized VJ...1BC Series Datasheet <https://www.mouser.com/datasheet/2/427/vjw1bcbascomseries-1762447.pdf> Samsung Datasheet <https://www.mouser.com/datasheet/2/585/MLCC-1837944.pdf> Walsin Datasheet <https://www.mouser.com/datasheet/2/210/WTC_MLCC_General_Purpose-1534899.pdf> GRM188R61A226ME15D <https://www.mouser.com/datasheet/2/281/1/GRM188R61A226ME15_02A-1985787.pdf> GRM188R61E106MA73D <https://www.mouser.com/datasheet/2/281/1/GRM188R61E106MA73_01A-1985806.pdf> 885012006013 <https://www.mouser.com/datasheet/2/445/885012006013-1726946.pdf> 2220Y6300105KXTWS2 <https://www.mouser.com/datasheet/2/218/SMD_High_and_Std_StackiCap_P62-1825512.pdf> Yageo Class 2, X5R <https://www.mouser.com/datasheet/2/447/UPY_GPHC_X5R_4V_to_50V_26-1827097.pdf> TDK C Series <https://www.mouser.com/ProductDetail/TDK/C3216X5R1V226M160AC?qs=%2Fha2pyFadujbcx9jh7lYl%2F4NeMoXFhdc8AqVWNq4wW6M2y7zl6GzBuhgtI0ngznN> AVX Automotive MLCC <https://www.mouser.com/datasheet/2/40/AutoMLCC-777028.pdf> KEMET X7R Series <https://www.mouser.com/datasheet/2/212/KEM_C1002_X7R_SMD-1102033.pdf> Kyocera AVX <https://www.mouser.com/datasheet/2/40/C0GNP0_Dielectric-951274.pdf> GRM21BR61H <https://www.mouser.com/datasheet/2/281/1/GRM21BR61H106KE43_01A-1986884.pdf> C1812W104KDRACTU <https://www.mouser.com/datasheet/2/212/KEM_C1034_X7R_HV_ARC_SMD-1101730.pdf>; CAPACITANCE: 4.7nF; DKPN: 732-7931-1-ND; MANUFACTURER: Würth Elektronik; MOPN: 710-885012206012; MPN: 885012206012; TOLERANCE: 10%; VOLTAGE: 10V
C60 = HyTechDevices:CAPACITOR_?_*: Capacitor, Non-Polarized VJ...1BC Series Datasheet <https://www.mouser.com/datasheet/2/427/vjw1bcbascomseries-1762447.pdf> Samsung Datasheet <https://www.mouser.com/datasheet/2/585/MLCC-1837944.pdf> Walsin Datasheet <https://www.mouser.com/datasheet/2/210/WTC_MLCC_General_Purpose-1534899.pdf> GRM188R61A226ME15D <https://www.mouser.com/datasheet/2/281/1/GRM188R61A226ME15_02A-1985787.pdf> GRM188R61E106MA73D <https://www.mouser.com/datasheet/2/281/1/GRM188R61E106MA73_01A-1985806.pdf> 885012006013 <https://www.mouser.com/datasheet/2/445/885012006013-1726946.pdf> 2220Y6300105KXTWS2 <https://www.mouser.com/datasheet/2/218/SMD_High_and_Std_StackiCap_P62-1825512.pdf> Yageo Class 2, X5R <https://www.mouser.com/datasheet/2/447/UPY_GPHC_X5R_4V_to_50V_26-1827097.pdf> TDK C Series <https://www.mouser.com/ProductDetail/TDK/C3216X5R1V226M160AC?qs=%2Fha2pyFadujbcx9jh7lYl%2F4NeMoXFhdc8AqVWNq4wW6M2y7zl6GzBuhgtI0ngznN> AVX Automotive MLCC <https://www.mouser.com/datasheet/2/40/AutoMLCC-777028.pdf> KEMET X7R Series <https://www.mouser.com/datasheet/2/212/KEM_C1002_X7R_SMD-1102033.pdf> Kyocera AVX <https://www.mouser.com/datasheet/2/40/C0GNP0_Dielectric-951274.pdf> GRM21BR61H <https://www.mouser.com/datasheet/2/281/1/GRM21BR61H106KE43_01A-1986884.pdf> C1812W104KDRACTU <https://www.mouser.com/datasheet/2/212/KEM_C1034_X7R_HV_ARC_SMD-1101730.pdf>; CAPACITANCE: 0.1µF; DKPN: 1276-1006-1-ND; MANUFACTURER: Samsung Electro-Mechanics; MOPN: 187-CL10B104KA8NNNC; MPN: CL10B104KA8NNNC; TOLERANCE: 10%; VOLTAGE: 25V
C62 = HyTechDevices:CAPACITOR_?_*: Capacitor, Non-Polarized VJ...1BC Series Datasheet <https://www.mouser.com/datasheet/2/427/vjw1bcbascomseries-1762447.pdf> Samsung Datasheet <https://www.mouser.com/datasheet/2/585/MLCC-1837944.pdf> Walsin Datasheet <https://www.mouser.com/datasheet/2/210/WTC_MLCC_General_Purpose-1534899.pdf> GRM188R61A226ME15D <https://www.mouser.com/datasheet/2/281/1/GRM188R61A226ME15_02A-1985787.pdf> GRM188R61E106MA73D <https://www.mouser.com/datasheet/2/281/1/GRM188R61E106MA73_01A-1985806.pdf> 885012006013 <https://www.mouser.com/datasheet/2/445/885012006013-1726946.pdf> 2220Y6300105KXTWS2 <https://www.mouser.com/datasheet/2/218/SMD_High_and_Std_StackiCap_P62-1825512.pdf> Yageo Class 2, X5R <https://www.mouser.com/datasheet/2/447/UPY_GPHC_X5R_4V_to_50V_26-1827097.pdf> TDK C Series <https://www.mouser.com/ProductDetail/TDK/C3216X5R1V226M160AC?qs=%2Fha2pyFadujbcx9jh7lYl%2F4NeMoXFhdc8AqVWNq4wW6M2y7zl6GzBuhgtI0ngznN> AVX Automotive MLCC <https://www.mouser.com/datasheet/2/40/AutoMLCC-777028.pdf> KEMET X7R Series <https://www.mouser.com/datasheet/2/212/KEM_C1002_X7R_SMD-1102033.pdf> Kyocera AVX <https://www.mouser.com/datasheet/2/40/C0GNP0_Dielectric-951274.pdf> GRM21BR61H <https://www.mouser.com/datasheet/2/281/1/GRM21BR61H106KE43_01A-1986884.pdf> C1812W104KDRACTU <https://www.mouser.com/datasheet/2/212/KEM_C1034_X7R_HV_ARC_SMD-1101730.pdf>; CAPACITANCE: 1µF; DKPN: 1276-1184-1-ND; MANUFACTURER: Samsung Electro-Mechanics; MOPN: 187-CL10B105KA8NNNC; MPN: CL10B105KA8NNNC; TOLERANCE: 10%; VOLTAGE: 25V
C88 = HyTechDevices:CAPACITOR_?_*: Capacitor, Non-Polarized VJ...1BC Series Datasheet <https://www.mouser.com/datasheet/2/427/vjw1bcbascomseries-1762447.pdf> Samsung Datasheet <https://www.mouser.com/datasheet/2/585/MLCC-1837944.pdf> Walsin Datasheet <https://www.mouser.com/datasheet/2/210/WTC_MLCC_General_Purpose-1534899.pdf> GRM188R61A226ME15D <https://www.mouser.com/datasheet/2/281/1/GRM188R61A226ME15_02A-1985787.pdf> GRM188R61E106MA73D <https://www.mouser.com/datasheet/2/281/1/GRM188R61E106MA73_01A-1985806.pdf> 885012006013 <https://www.mouser.com/datasheet/2/445/885012006013-1726946.pdf> 2220Y6300105KXTWS2 <https://www.mouser.com/datasheet/2/218/SMD_High_and_Std_StackiCap_P62-1825512.pdf> Yageo Class 2, X5R <https://www.mouser.com/datasheet/2/447/UPY_GPHC_X5R_4V_to_50V_26-1827097.pdf> TDK C Series <https://www.mouser.com/ProductDetail/TDK/C3216X5R1V226M160AC?qs=%2Fha2pyFadujbcx9jh7lYl%2F4NeMoXFhdc8AqVWNq4wW6M2y7zl6GzBuhgtI0ngznN> AVX Automotive MLCC <https://www.mouser.com/datasheet/2/40/AutoMLCC-777028.pdf> KEMET X7R Series <https://www.mouser.com/datasheet/2/212/KEM_C1002_X7R_SMD-1102033.pdf> Kyocera AVX <https://www.mouser.com/datasheet/2/40/C0GNP0_Dielectric-951274.pdf> GRM21BR61H <https://www.mouser.com/datasheet/2/281/1/GRM21BR61H106KE43_01A-1986884.pdf> C1812W104KDRACTU <https://www.mouser.com/datasheet/2/212/KEM_C1034_X7R_HV_ARC_SMD-1101730.pdf>; CAPACITANCE: 10uF; DKPN: 490-18663-2-ND; MANUFACTURER: Murata; MOPN: 81-GRM21BR61H106KE3L; MPN: GRM21BR61H106KE43L; TOLERANCE: 10%; VOLTAGE: 50V
D1-D3 = HyTechDevices:TVS_BIDIRECTIONAL_DUAL: Bdirectional TVS for CAN ESD Datasheet <https://www.ti.com/lit/ds/symlink/tpd2e007.pdf?HQS=dis-mous-null-mousermode-dsf-pf-null-wwe&ts=1615155679700&ref_url=https%253A%252F%252Fwww.mouser.com%252F>; DKPN: 296-25281-1-ND; MANUFACTURER: Texas Instruments; MOPN: 595-TPD2E007DCKR; MPN: TPD2E007DCKR
D4 D12-D20 = HyTechDevices:SCHOTTKY_?_*: CUS08F30 Shottky Diode Datasheet <https://www.mouser.com/datasheet/2/408/CUS08F30_datasheet_en_20140414-1916097.pdf>; CURRENT: 0.8A; DKPN: CUS08F30H3FTR-ND; MANUFACTURER: Toshiba Semiconductor and Storage; MOPN: 757-CUS08F30H3F; MPN: CUS08F30; VOLTAGE: 30V
D5 = HyTechDevices:TVS_?_*: TVS Diode GSOT Datasheet <https://www.mouser.com/datasheet/2/427/gsot03-1767593.pdf>; DKPN: GSOT03-E3-08CT-ND; MANUFACTURER: Vishay General Semiconductor - Diodes Division; MOPN: 78-GSOT03-E3-08; MPN: GSOT03-E3-08; VOLTAGE: 3.3V
D6-D11 D21 D22 D27 = HyTechDevices:TVS_?_*: TVS Diode GSOT Datasheet <https://www.mouser.com/datasheet/2/427/gsot03-1767593.pdf>; DKPN: 118-1.5SMBJ28ATR-ND; MANUFACTURER: Bourns Inc.; MOPN: 652-1.5SMBJ28A; MPN: 1.5SMBJ28A; VOLTAGE: 28V
D23-D26 = HyTechDevices:TVS_?_*: TVS Diode GSOT Datasheet <https://www.mouser.com/datasheet/2/427/gsot03-1767593.pdf>; DKPN: GSOT15-E3-08CT-ND; MANUFACTURER: Vishay General Semiconductor - Diodes Division; MOPN: 78-GSOT15-E3-08; MPN: GSOT15-E3-08; VOLTAGE: 15V
J1 J2 = HyTechDevices:CONNECTOR-34_?_*: 34 pin ribbon connector header (EHT-117-01) Catalog <https://suddendocs.samtec.com/catalog_english/eht.pdf> Datasheet <http://suddendocs.samtec.com/prints/eht-d.pdf> Part <https://www.digikey.com/en/products/detail/samtec-inc/EHT-117-01-L-D/6694623>; DKPN: SAM15557-ND; MANUFACTURER: Samtec; MOPN: 200-EHT11701LD; MPN: EHT-117-01-L-D
J3 = HyTechDevices:ADIS16460*: 14 pin connector specifically for ADIS16460 IMU Samtec Tiger Claw Datasheet <https://suddendocs.samtec.com/catalog_english/clm_sm.pdf> ADIS16460 Datasheet <https://www.analog.com/media/en/technical-documentation/data-sheets/ADIS16460.pdf>; DKPN: SAM1129-07-ND; MANUFACTURER: Samtec Inc.; MPN: CLM-107-02
JP1-JP5 = HyTechDevices:JUMPER_?_*: 2 Pin Connector; DKPN: S1011EC-02-ND; MANUFACTURER: Sullins Connector Solutions; MPN: PRPC002SAAN-RC
JP6-JP13 = HyTechDevices:JUMPER_?_*: 2 Pin Connector; DKPN: 13-RC0603FR-130RLTR-ND; MANUFACTURER: YAGEO; MOPN: 603-RC0603FR-130RL; MPN: RC0603FR-130RL
K1-K5 = HyTechDevices:RELAY_DPDT_*: Dual Pole, Dual Throw Relay Datasheet <https://www.mouser.com/datasheet/2/418/5/NG_DS_RT2_1014-572844.pdf>; DKPN: PB2077CT-ND; MANUFACTURER: TE Connectivity; MOPN: 655-3-1462039-7; MPN: 3-1462039-7
LATCH = HyTechDevices:LED_?_*: LED 0603 Blue <https://www.mouser.com/datasheet/2/216/APT1608VBC_D-246010.pdf> Green <https://www.mouser.com/datasheet/2/216/APT1608ZGCK-1173388.pdf> Orange <https://www.mouser.com/datasheet/2/216/APT1608SECK-6197.pdf> Red <https://www.mouser.com/datasheet/2/216/APT1608SECK-J3-PRV-1173336.pdf> White <https://www.mouser.com/datasheet/2/50/SM0603UWC-880813.pdf> Yellow <https://www.mouser.com/datasheet/2/216/APT1608SYCK-J3-PRV-1173311.pdf> 2835 (Series not on Digikey) Lumiled LUXEON 2835 Color Line <https://www.mouser.com/datasheet/2/602/DS236_luxeon_2835_color_line_datasheet-1596094.pdf>; COLOR: White; DKPN: SM0603UWC-ND; MANUFACTURER: Bivar Inc.; MOPN: 749-SM0603UWC; MPN: SM0603UWC
Q1 Q4 = HyTechDevices:TRANSISTOR_N_MOS_?_*: N-MOSFET PMV15ENEA Datasheet <https://www.mouser.com/datasheet/2/916/PMV15ENEA-1604828.pdf> TK6P65W Datasheet <https://www.mouser.com/datasheet/2/408/TK6P65W_datasheet_en_20151225-1916290.pdf> SIR638ADP Datasheet <https://www.mouser.com/datasheet/2/427/sir638adp-1766131.pdf> DMG3406L Datasheet <https://www.diodes.com/assets/Datasheets/DMG3406L.pdf> STL2N80K5 <https://www.mouser.com/datasheet/2/389/dm00092662-1798082.pdf>; DKPN: DMG3406L-7DITR-ND; MANUFACTURER: Diodes Incorporated; MOPN: 621-DMG3406L-7; MPN: DMG3406L-7
Q2 Q3 = HyTechDevices:TRANSISTOR_P_MOS_?_*: P-MOSFET SI2369DS Datasheet <https://www.mouser.com/datasheet/2/427/si2369d-1764360.pdf> DMP3056L Datasheet <https://www.mouser.com/datasheet/2/115/DIOD_S_A0012915142_1-2543925.pdf>; DKPN: DMP3056L-7DITR-ND; MANUFACTURER: Diodes Incorporated; MOPN: 621-DMP3056L-7; MPN: DMP3056L-7
R1 R25 R27 R43 R74 R78 R82 R88 R89 R99 R100 = HyTechDevices:RESISTOR_?_*: Resistor PWR163 Series <https://www.mouser.com/datasheet/2/54/pwr163-777985.pdf> AC Series <https://www.mouser.com/datasheet/2/447/Yageo_PYu_AC_51_RoHS_L_7_1714230-1874691.pdf> PU Series <https://www.mouser.com/datasheet/2/447/PYu-PU_51_RoHS_L_6-1504619.pdf> ERA Series <https://www.mouser.com/datasheet/2/315/AOA0000C307-1149632.pdf> PWR263 Series <https://www.mouser.com/datasheet/2/54/pwr263s_35-778069.pdf> KTR Series <https://www.mouser.com/datasheet/2/348/ROHM_S_A0011075115_1-2563276.pdf> RC Series <https://www.mouser.com/datasheet/2/447/Yageo_03_18_2021_PYu_RC_Group_51_RoHS_L_11-2199992.pdf> ERJ PB3, PB6 Series <https://www.mouser.com/datasheet/2/315/AOA0000C328-1530132.pdf> ERJ PA2, P03, PA3, P06, P08, P14 Series <https://www.mouser.com/datasheet/2/315/AOA0000C331-1141874.pdf> B20 Series <https://www.ohmite.com/assets/docs/res_200.pdf?r=false> TE Connectivity/Holsworthy RN73 Series <https://www.mouser.com/datasheet/2/418/4/NG_DS_1773270_M-604713.pdf> Vishay Dale D/CRCW e3 <https://www.mouser.com/datasheet/2/427/dcrcwe3-1762152.pdf> Ohmite B20 <https://www.ohmite.com/assets/docs/res_200.pdf?r=false>; DKPN: 311-1.24KHRCT-ND; MANUFACTURER: Yageo; MOPN: 603-RC0603FR-071K24L; MPN: RC0603FR-071K24L; POWER: 0.1W; RESISTANCE: 1.24k; TOLERANCE: 1%; VOLTAGE_CONTINUOUS: 11.14V; VOLTAGE_MAX: 75V
R2 R21 R23 R26 R28 R37 R39 R41 R44 R65 R75-R77 R79-R81 R83-R85 R90 R91 R93 R96 R98 R101-R104 R107 R108 = HyTechDevices:RESISTOR_?_*: Resistor PWR163 Series <https://www.mouser.com/datasheet/2/54/pwr163-777985.pdf> AC Series <https://www.mouser.com/datasheet/2/447/Yageo_PYu_AC_51_RoHS_L_7_1714230-1874691.pdf> PU Series <https://www.mouser.com/datasheet/2/447/PYu-PU_51_RoHS_L_6-1504619.pdf> ERA Series <https://www.mouser.com/datasheet/2/315/AOA0000C307-1149632.pdf> PWR263 Series <https://www.mouser.com/datasheet/2/54/pwr263s_35-778069.pdf> KTR Series <https://www.mouser.com/datasheet/2/348/ROHM_S_A0011075115_1-2563276.pdf> RC Series <https://www.mouser.com/datasheet/2/447/Yageo_03_18_2021_PYu_RC_Group_51_RoHS_L_11-2199992.pdf> ERJ PB3, PB6 Series <https://www.mouser.com/datasheet/2/315/AOA0000C328-1530132.pdf> ERJ PA2, P03, PA3, P06, P08, P14 Series <https://www.mouser.com/datasheet/2/315/AOA0000C331-1141874.pdf> B20 Series <https://www.ohmite.com/assets/docs/res_200.pdf?r=false> TE Connectivity/Holsworthy RN73 Series <https://www.mouser.com/datasheet/2/418/4/NG_DS_1773270_M-604713.pdf> Vishay Dale D/CRCW e3 <https://www.mouser.com/datasheet/2/427/dcrcwe3-1762152.pdf> Ohmite B20 <https://www.ohmite.com/assets/docs/res_200.pdf?r=false>; DKPN: P10KBDCT-ND; MANUFACTURER: Panasonic Electronic Components; MOPN: 667-ERA-3ARB103V; MPN: ERA-3ARB103V; POWER: 0.1W; RESISTANCE: 10k; TOLERANCE: 0.1%; VOLTAGE_CONTINUOUS: 31.62V; VOLTAGE_MAX: 75V
R3 R6 R9 R12 R15 R18 R30-R33 R66-R70 = HyTechDevices:RESISTOR_?_*: Resistor PWR163 Series <https://www.mouser.com/datasheet/2/54/pwr163-777985.pdf> AC Series <https://www.mouser.com/datasheet/2/447/Yageo_PYu_AC_51_RoHS_L_7_1714230-1874691.pdf> PU Series <https://www.mouser.com/datasheet/2/447/PYu-PU_51_RoHS_L_6-1504619.pdf> ERA Series <https://www.mouser.com/datasheet/2/315/AOA0000C307-1149632.pdf> PWR263 Series <https://www.mouser.com/datasheet/2/54/pwr263s_35-778069.pdf> KTR Series <https://www.mouser.com/datasheet/2/348/ROHM_S_A0011075115_1-2563276.pdf> RC Series <https://www.mouser.com/datasheet/2/447/Yageo_03_18_2021_PYu_RC_Group_51_RoHS_L_11-2199992.pdf> ERJ PB3, PB6 Series <https://www.mouser.com/datasheet/2/315/AOA0000C328-1530132.pdf> ERJ PA2, P03, PA3, P06, P08, P14 Series <https://www.mouser.com/datasheet/2/315/AOA0000C331-1141874.pdf> B20 Series <https://www.ohmite.com/assets/docs/res_200.pdf?r=false> TE Connectivity/Holsworthy RN73 Series <https://www.mouser.com/datasheet/2/418/4/NG_DS_1773270_M-604713.pdf> Vishay Dale D/CRCW e3 <https://www.mouser.com/datasheet/2/427/dcrcwe3-1762152.pdf> Ohmite B20 <https://www.ohmite.com/assets/docs/res_200.pdf?r=false>; DKPN: 10-ERJ-UP3F2001VTR-ND; MANUFACTURER: Panasonic Electronic Components; MOPN: 667-ERJ-UP3F2001V; MPN: ERJ-UP3F2001V; POWER: 0.25W; RESISTANCE: 2k; TOLERANCE: 1%; VOLTAGE_CONTINUOUS: 22.36V; VOLTAGE_MAX: 150V
R4 R7 R10 R13 R16 R19 R46 R48 R106 = HyTechDevices:RESISTOR_?_*: Resistor PWR163 Series <https://www.mouser.com/datasheet/2/54/pwr163-777985.pdf> AC Series <https://www.mouser.com/datasheet/2/447/Yageo_PYu_AC_51_RoHS_L_7_1714230-1874691.pdf> PU Series <https://www.mouser.com/datasheet/2/447/PYu-PU_51_RoHS_L_6-1504619.pdf> ERA Series <https://www.mouser.com/datasheet/2/315/AOA0000C307-1149632.pdf> PWR263 Series <https://www.mouser.com/datasheet/2/54/pwr263s_35-778069.pdf> KTR Series <https://www.mouser.com/datasheet/2/348/ROHM_S_A0011075115_1-2563276.pdf> RC Series <https://www.mouser.com/datasheet/2/447/Yageo_03_18_2021_PYu_RC_Group_51_RoHS_L_11-2199992.pdf> ERJ PB3, PB6 Series <https://www.mouser.com/datasheet/2/315/AOA0000C328-1530132.pdf> ERJ PA2, P03, PA3, P06, P08, P14 Series <https://www.mouser.com/datasheet/2/315/AOA0000C331-1141874.pdf> B20 Series <https://www.ohmite.com/assets/docs/res_200.pdf?r=false> TE Connectivity/Holsworthy RN73 Series <https://www.mouser.com/datasheet/2/418/4/NG_DS_1773270_M-604713.pdf> Vishay Dale D/CRCW e3 <https://www.mouser.com/datasheet/2/427/dcrcwe3-1762152.pdf> Ohmite B20 <https://www.ohmite.com/assets/docs/res_200.pdf?r=false>; DKPN: 311-4.64KHRCT-ND; MANUFACTURER: Yageo; MOPN: 603-RC0603FR-074K64L; MPN: RC0603FR-074K64L; POWER: 0.1W; RESISTANCE: 4.64k; TOLERANCE: 1%; VOLTAGE_CONTINUOUS: 21.54V; VOLTAGE_MAX: 75V
R5 R8 R11 R14 R17 R20 R45 R47 R105 = HyTechDevices:RESISTOR_?_*: Resistor PWR163 Series <https://www.mouser.com/datasheet/2/54/pwr163-777985.pdf> AC Series <https://www.mouser.com/datasheet/2/447/Yageo_PYu_AC_51_RoHS_L_7_1714230-1874691.pdf> PU Series <https://www.mouser.com/datasheet/2/447/PYu-PU_51_RoHS_L_6-1504619.pdf> ERA Series <https://www.mouser.com/datasheet/2/315/AOA0000C307-1149632.pdf> PWR263 Series <https://www.mouser.com/datasheet/2/54/pwr263s_35-778069.pdf> KTR Series <https://www.mouser.com/datasheet/2/348/ROHM_S_A0011075115_1-2563276.pdf> RC Series <https://www.mouser.com/datasheet/2/447/Yageo_03_18_2021_PYu_RC_Group_51_RoHS_L_11-2199992.pdf> ERJ PB3, PB6 Series <https://www.mouser.com/datasheet/2/315/AOA0000C328-1530132.pdf> ERJ PA2, P03, PA3, P06, P08, P14 Series <https://www.mouser.com/datasheet/2/315/AOA0000C331-1141874.pdf> B20 Series <https://www.ohmite.com/assets/docs/res_200.pdf?r=false> TE Connectivity/Holsworthy RN73 Series <https://www.mouser.com/datasheet/2/418/4/NG_DS_1773270_M-604713.pdf> Vishay Dale D/CRCW e3 <https://www.mouser.com/datasheet/2/427/dcrcwe3-1762152.pdf> Ohmite B20 <https://www.ohmite.com/assets/docs/res_200.pdf?r=false>; DKPN: 311-36.5KHRCT-ND; MANUFACTURER: Yageo; MOPN: 603-RC0603FR-0736K5L; MPN: RC0603FR-0736K5L; POWER: 0.1W; RESISTANCE: 36.5k; TOLERANCE: 1%; VOLTAGE_CONTINUOUS: 60.42V; VOLTAGE_MAX: 75V
R22 R24 R38 R40 R42 = HyTechDevices:RESISTOR_?_*: Resistor PWR163 Series <https://www.mouser.com/datasheet/2/54/pwr163-777985.pdf> AC Series <https://www.mouser.com/datasheet/2/447/Yageo_PYu_AC_51_RoHS_L_7_1714230-1874691.pdf> PU Series <https://www.mouser.com/datasheet/2/447/PYu-PU_51_RoHS_L_6-1504619.pdf> ERA Series <https://www.mouser.com/datasheet/2/315/AOA0000C307-1149632.pdf> PWR263 Series <https://www.mouser.com/datasheet/2/54/pwr263s_35-778069.pdf> KTR Series <https://www.mouser.com/datasheet/2/348/ROHM_S_A0011075115_1-2563276.pdf> RC Series <https://www.mouser.com/datasheet/2/447/Yageo_03_18_2021_PYu_RC_Group_51_RoHS_L_11-2199992.pdf> ERJ PB3, PB6 Series <https://www.mouser.com/datasheet/2/315/AOA0000C328-1530132.pdf> ERJ PA2, P03, PA3, P06, P08, P14 Series <https://www.mouser.com/datasheet/2/315/AOA0000C331-1141874.pdf> B20 Series <https://www.ohmite.com/assets/docs/res_200.pdf?r=false> TE Connectivity/Holsworthy RN73 Series <https://www.mouser.com/datasheet/2/418/4/NG_DS_1773270_M-604713.pdf> Vishay Dale D/CRCW e3 <https://www.mouser.com/datasheet/2/427/dcrcwe3-1762152.pdf> Ohmite B20 <https://www.ohmite.com/assets/docs/res_200.pdf?r=false>; DKPN: P15KBDCT-ND; MANUFACTURER: Panasonic Electronic Components; MOPN: 667-ERA-3ARB153V; MPN: ERA-3ARB153V; POWER: 0.1W; RESISTANCE: 15k; TOLERANCE: 0.1%; VOLTAGE_CONTINUOUS: 38.73V; VOLTAGE_MAX: 75V
R29 R36 = HyTechDevices:RESISTOR_?_*: Resistor PWR163 Series <https://www.mouser.com/datasheet/2/54/pwr163-777985.pdf> AC Series <https://www.mouser.com/datasheet/2/447/Yageo_PYu_AC_51_RoHS_L_7_1714230-1874691.pdf> PU Series <https://www.mouser.com/datasheet/2/447/PYu-PU_51_RoHS_L_6-1504619.pdf> ERA Series <https://www.mouser.com/datasheet/2/315/AOA0000C307-1149632.pdf> PWR263 Series <https://www.mouser.com/datasheet/2/54/pwr263s_35-778069.pdf> KTR Series <https://www.mouser.com/datasheet/2/348/ROHM_S_A0011075115_1-2563276.pdf> RC Series <https://www.mouser.com/datasheet/2/447/Yageo_03_18_2021_PYu_RC_Group_51_RoHS_L_11-2199992.pdf> ERJ PB3, PB6 Series <https://www.mouser.com/datasheet/2/315/AOA0000C328-1530132.pdf> ERJ PA2, P03, PA3, P06, P08, P14 Series <https://www.mouser.com/datasheet/2/315/AOA0000C331-1141874.pdf> B20 Series <https://www.ohmite.com/assets/docs/res_200.pdf?r=false> TE Connectivity/Holsworthy RN73 Series <https://www.mouser.com/datasheet/2/418/4/NG_DS_1773270_M-604713.pdf> Vishay Dale D/CRCW e3 <https://www.mouser.com/datasheet/2/427/dcrcwe3-1762152.pdf> Ohmite B20 <https://www.ohmite.com/assets/docs/res_200.pdf?r=false>; DKPN: P120DBCT-ND; MANUFACTURER: Panasonic Electronic Components; MOPN: 667-ERA-3AEB121V; MPN: ERA-3AEB121V; POWER: 0.1W; RESISTANCE: 120; TOLERANCE: 0.1%; VOLTAGE_CONTINUOUS: 3.46V; VOLTAGE_MAX: 75V
R34 = HyTechDevices:RESISTOR_?_*: Resistor PWR163 Series <https://www.mouser.com/datasheet/2/54/pwr163-777985.pdf> AC Series <https://www.mouser.com/datasheet/2/447/Yageo_PYu_AC_51_RoHS_L_7_1714230-1874691.pdf> PU Series <https://www.mouser.com/datasheet/2/447/PYu-PU_51_RoHS_L_6-1504619.pdf> ERA Series <https://www.mouser.com/datasheet/2/315/AOA0000C307-1149632.pdf> PWR263 Series <https://www.mouser.com/datasheet/2/54/pwr263s_35-778069.pdf> KTR Series <https://www.mouser.com/datasheet/2/348/ROHM_S_A0011075115_1-2563276.pdf> RC Series <https://www.mouser.com/datasheet/2/447/Yageo_03_18_2021_PYu_RC_Group_51_RoHS_L_11-2199992.pdf> ERJ PB3, PB6 Series <https://www.mouser.com/datasheet/2/315/AOA0000C328-1530132.pdf> ERJ PA2, P03, PA3, P06, P08, P14 Series <https://www.mouser.com/datasheet/2/315/AOA0000C331-1141874.pdf> B20 Series <https://www.ohmite.com/assets/docs/res_200.pdf?r=false> TE Connectivity/Holsworthy RN73 Series <https://www.mouser.com/datasheet/2/418/4/NG_DS_1773270_M-604713.pdf> Vishay Dale D/CRCW e3 <https://www.mouser.com/datasheet/2/427/dcrcwe3-1762152.pdf> Ohmite B20 <https://www.ohmite.com/assets/docs/res_200.pdf?r=false>; DKPN: 311-180HRCT-ND; MANUFACTURER: Yageo; MOPN: 603-RC0603FR-07180RL; MPN: RC0603FR-07180RL; POWER: 0.1W; RESISTANCE: 180; TOLERANCE: 1%; VOLTAGE_CONTINUOUS: 4.24V; VOLTAGE_MAX: 75V
R35 R53 R56 R59 R60 = HyTechDevices:RESISTOR_?_*: Resistor PWR163 Series <https://www.mouser.com/datasheet/2/54/pwr163-777985.pdf> AC Series <https://www.mouser.com/datasheet/2/447/Yageo_PYu_AC_51_RoHS_L_7_1714230-1874691.pdf> PU Series <https://www.mouser.com/datasheet/2/447/PYu-PU_51_RoHS_L_6-1504619.pdf> ERA Series <https://www.mouser.com/datasheet/2/315/AOA0000C307-1149632.pdf> PWR263 Series <https://www.mouser.com/datasheet/2/54/pwr263s_35-778069.pdf> KTR Series <https://www.mouser.com/datasheet/2/348/ROHM_S_A0011075115_1-2563276.pdf> RC Series <https://www.mouser.com/datasheet/2/447/Yageo_03_18_2021_PYu_RC_Group_51_RoHS_L_11-2199992.pdf> ERJ PB3, PB6 Series <https://www.mouser.com/datasheet/2/315/AOA0000C328-1530132.pdf> ERJ PA2, P03, PA3, P06, P08, P14 Series <https://www.mouser.com/datasheet/2/315/AOA0000C331-1141874.pdf> B20 Series <https://www.ohmite.com/assets/docs/res_200.pdf?r=false> TE Connectivity/Holsworthy RN73 Series <https://www.mouser.com/datasheet/2/418/4/NG_DS_1773270_M-604713.pdf> Vishay Dale D/CRCW e3 <https://www.mouser.com/datasheet/2/427/dcrcwe3-1762152.pdf> Ohmite B20 <https://www.ohmite.com/assets/docs/res_200.pdf?r=false>; DKPN: 311-240HRCT-ND; MANUFACTURER: Yageo; MOPN: 603-RC0603FR-07240RL; MPN: RC0603FR-07240RL; POWER: 0.1W; RESISTANCE: 240; TOLERANCE: 1%; VOLTAGE_CONTINUOUS: 4.90V; VOLTAGE_MAX: 75V
R49 R52 R72 R73 R86 R87 = HyTechDevices:RESISTOR_?_*: Resistor PWR163 Series <https://www.mouser.com/datasheet/2/54/pwr163-777985.pdf> AC Series <https://www.mouser.com/datasheet/2/447/Yageo_PYu_AC_51_RoHS_L_7_1714230-1874691.pdf> PU Series <https://www.mouser.com/datasheet/2/447/PYu-PU_51_RoHS_L_6-1504619.pdf> ERA Series <https://www.mouser.com/datasheet/2/315/AOA0000C307-1149632.pdf> PWR263 Series <https://www.mouser.com/datasheet/2/54/pwr263s_35-778069.pdf> KTR Series <https://www.mouser.com/datasheet/2/348/ROHM_S_A0011075115_1-2563276.pdf> RC Series <https://www.mouser.com/datasheet/2/447/Yageo_03_18_2021_PYu_RC_Group_51_RoHS_L_11-2199992.pdf> ERJ PB3, PB6 Series <https://www.mouser.com/datasheet/2/315/AOA0000C328-1530132.pdf> ERJ PA2, P03, PA3, P06, P08, P14 Series <https://www.mouser.com/datasheet/2/315/AOA0000C331-1141874.pdf> B20 Series <https://www.ohmite.com/assets/docs/res_200.pdf?r=false> TE Connectivity/Holsworthy RN73 Series <https://www.mouser.com/datasheet/2/418/4/NG_DS_1773270_M-604713.pdf> Vishay Dale D/CRCW e3 <https://www.mouser.com/datasheet/2/427/dcrcwe3-1762152.pdf> Ohmite B20 <https://www.ohmite.com/assets/docs/res_200.pdf?r=false>; DKPN: 311-60.4HRCT-ND; MANUFACTURER: Yageo; MOPN: 603-RC0603FR-0760R4L; MPN: RC0603FR-0760R4L; POWER: 0.1W; RESISTANCE: 60.4; TOLERANCE: 1%; VOLTAGE_CONTINUOUS: 2.48V; VOLTAGE_MAX: 75V
R50 R55 R57 = HyTechDevices:RESISTOR_?_*: Resistor PWR163 Series <https://www.mouser.com/datasheet/2/54/pwr163-777985.pdf> AC Series <https://www.mouser.com/datasheet/2/447/Yageo_PYu_AC_51_RoHS_L_7_1714230-1874691.pdf> PU Series <https://www.mouser.com/datasheet/2/447/PYu-PU_51_RoHS_L_6-1504619.pdf> ERA Series <https://www.mouser.com/datasheet/2/315/AOA0000C307-1149632.pdf> PWR263 Series <https://www.mouser.com/datasheet/2/54/pwr263s_35-778069.pdf> KTR Series <https://www.mouser.com/datasheet/2/348/ROHM_S_A0011075115_1-2563276.pdf> RC Series <https://www.mouser.com/datasheet/2/447/Yageo_03_18_2021_PYu_RC_Group_51_RoHS_L_11-2199992.pdf> ERJ PB3, PB6 Series <https://www.mouser.com/datasheet/2/315/AOA0000C328-1530132.pdf> ERJ PA2, P03, PA3, P06, P08, P14 Series <https://www.mouser.com/datasheet/2/315/AOA0000C331-1141874.pdf> B20 Series <https://www.ohmite.com/assets/docs/res_200.pdf?r=false> TE Connectivity/Holsworthy RN73 Series <https://www.mouser.com/datasheet/2/418/4/NG_DS_1773270_M-604713.pdf> Vishay Dale D/CRCW e3 <https://www.mouser.com/datasheet/2/427/dcrcwe3-1762152.pdf> Ohmite B20 <https://www.ohmite.com/assets/docs/res_200.pdf?r=false>; DKPN: P1.13KHCT-ND; MANUFACTURER: Panasonic Electronic Components; MOPN: 667-ERJ-3EKF1131V; MPN: ERJ-3EKF1131V; POWER: 0.1W; RESISTANCE: 1.13k; TOLERANCE: 1%; VOLTAGE_CONTINUOUS: 75V; VOLTAGE_MAX: 150V
R51 R54 R58 = HyTechDevices:RESISTOR_?_*: Resistor PWR163 Series <https://www.mouser.com/datasheet/2/54/pwr163-777985.pdf> AC Series <https://www.mouser.com/datasheet/2/447/Yageo_PYu_AC_51_RoHS_L_7_1714230-1874691.pdf> PU Series <https://www.mouser.com/datasheet/2/447/PYu-PU_51_RoHS_L_6-1504619.pdf> ERA Series <https://www.mouser.com/datasheet/2/315/AOA0000C307-1149632.pdf> PWR263 Series <https://www.mouser.com/datasheet/2/54/pwr263s_35-778069.pdf> KTR Series <https://www.mouser.com/datasheet/2/348/ROHM_S_A0011075115_1-2563276.pdf> RC Series <https://www.mouser.com/datasheet/2/447/Yageo_03_18_2021_PYu_RC_Group_51_RoHS_L_11-2199992.pdf> ERJ PB3, PB6 Series <https://www.mouser.com/datasheet/2/315/AOA0000C328-1530132.pdf> ERJ PA2, P03, PA3, P06, P08, P14 Series <https://www.mouser.com/datasheet/2/315/AOA0000C331-1141874.pdf> B20 Series <https://www.ohmite.com/assets/docs/res_200.pdf?r=false> TE Connectivity/Holsworthy RN73 Series <https://www.mouser.com/datasheet/2/418/4/NG_DS_1773270_M-604713.pdf> Vishay Dale D/CRCW e3 <https://www.mouser.com/datasheet/2/427/dcrcwe3-1762152.pdf> Ohmite B20 <https://www.ohmite.com/assets/docs/res_200.pdf?r=false>; DKPN: P10.2KDBCT-ND; MANUFACTURER: Panasonic Electronic Components; MOPN: 667-ERA-3AEB1022V; MPN: ERA-3AEB1022V; POWER: 0.1W; RESISTANCE: 10.2k; TOLERANCE: 0.1%; VOLTAGE_CONTINUOUS: 31.94V; VOLTAGE_MAX: 75V
R61 R71 = HyTechDevices:RESISTOR_?_*: Resistor PWR163 Series <https://www.mouser.com/datasheet/2/54/pwr163-777985.pdf> AC Series <https://www.mouser.com/datasheet/2/447/Yageo_PYu_AC_51_RoHS_L_7_1714230-1874691.pdf> PU Series <https://www.mouser.com/datasheet/2/447/PYu-PU_51_RoHS_L_6-1504619.pdf> ERA Series <https://www.mouser.com/datasheet/2/315/AOA0000C307-1149632.pdf> PWR263 Series <https://www.mouser.com/datasheet/2/54/pwr263s_35-778069.pdf> KTR Series <https://www.mouser.com/datasheet/2/348/ROHM_S_A0011075115_1-2563276.pdf> RC Series <https://www.mouser.com/datasheet/2/447/Yageo_03_18_2021_PYu_RC_Group_51_RoHS_L_11-2199992.pdf> ERJ PB3, PB6 Series <https://www.mouser.com/datasheet/2/315/AOA0000C328-1530132.pdf> ERJ PA2, P03, PA3, P06, P08, P14 Series <https://www.mouser.com/datasheet/2/315/AOA0000C331-1141874.pdf> B20 Series <https://www.ohmite.com/assets/docs/res_200.pdf?r=false> TE Connectivity/Holsworthy RN73 Series <https://www.mouser.com/datasheet/2/418/4/NG_DS_1773270_M-604713.pdf> Vishay Dale D/CRCW e3 <https://www.mouser.com/datasheet/2/427/dcrcwe3-1762152.pdf> Ohmite B20 <https://www.ohmite.com/assets/docs/res_200.pdf?r=false>; DKPN: 311-43.0KHRCT-ND; MANUFACTURER: Yageo; MOPN: 603-RC0603FR-0743KL; MPN: RC0603FR-0743KL; POWER: 0.1W; RESISTANCE: 43k; TOLERANCE: 1%; VOLTAGE_CONTINUOUS: 65.57V; VOLTAGE_MAX: 75V
R62 R63 = HyTechDevices:RESISTOR_?_*: Resistor PWR163 Series <https://www.mouser.com/datasheet/2/54/pwr163-777985.pdf> AC Series <https://www.mouser.com/datasheet/2/447/Yageo_PYu_AC_51_RoHS_L_7_1714230-1874691.pdf> PU Series <https://www.mouser.com/datasheet/2/447/PYu-PU_51_RoHS_L_6-1504619.pdf> ERA Series <https://www.mouser.com/datasheet/2/315/AOA0000C307-1149632.pdf> PWR263 Series <https://www.mouser.com/datasheet/2/54/pwr263s_35-778069.pdf> KTR Series <https://www.mouser.com/datasheet/2/348/ROHM_S_A0011075115_1-2563276.pdf> RC Series <https://www.mouser.com/datasheet/2/447/Yageo_03_18_2021_PYu_RC_Group_51_RoHS_L_11-2199992.pdf> ERJ PB3, PB6 Series <https://www.mouser.com/datasheet/2/315/AOA0000C328-1530132.pdf> ERJ PA2, P03, PA3, P06, P08, P14 Series <https://www.mouser.com/datasheet/2/315/AOA0000C331-1141874.pdf> B20 Series <https://www.ohmite.com/assets/docs/res_200.pdf?r=false> TE Connectivity/Holsworthy RN73 Series <https://www.mouser.com/datasheet/2/418/4/NG_DS_1773270_M-604713.pdf> Vishay Dale D/CRCW e3 <https://www.mouser.com/datasheet/2/427/dcrcwe3-1762152.pdf> Ohmite B20 <https://www.ohmite.com/assets/docs/res_200.pdf?r=false>; DKPN: 1712-CPF-A-0603B1K0ETR-ND; MANUFACTURER: TE Connectivity Passive Product; MOPN: 279-CPF-A-0603B1K0E; MPN: CPF-A-0603B1K0E; POWER: 0.0625W; RESISTANCE: 1k; TOLERANCE: 0.1%; VOLTAGE_CONTINUOUS: 7.9V; VOLTAGE_MAX: 50V
R64 = HyTechDevices:RESISTOR_?_*: Resistor PWR163 Series <https://www.mouser.com/datasheet/2/54/pwr163-777985.pdf> AC Series <https://www.mouser.com/datasheet/2/447/Yageo_PYu_AC_51_RoHS_L_7_1714230-1874691.pdf> PU Series <https://www.mouser.com/datasheet/2/447/PYu-PU_51_RoHS_L_6-1504619.pdf> ERA Series <https://www.mouser.com/datasheet/2/315/AOA0000C307-1149632.pdf> PWR263 Series <https://www.mouser.com/datasheet/2/54/pwr263s_35-778069.pdf> KTR Series <https://www.mouser.com/datasheet/2/348/ROHM_S_A0011075115_1-2563276.pdf> RC Series <https://www.mouser.com/datasheet/2/447/Yageo_03_18_2021_PYu_RC_Group_51_RoHS_L_11-2199992.pdf> ERJ PB3, PB6 Series <https://www.mouser.com/datasheet/2/315/AOA0000C328-1530132.pdf> ERJ PA2, P03, PA3, P06, P08, P14 Series <https://www.mouser.com/datasheet/2/315/AOA0000C331-1141874.pdf> B20 Series <https://www.ohmite.com/assets/docs/res_200.pdf?r=false> TE Connectivity/Holsworthy RN73 Series <https://www.mouser.com/datasheet/2/418/4/NG_DS_1773270_M-604713.pdf> Vishay Dale D/CRCW e3 <https://www.mouser.com/datasheet/2/427/dcrcwe3-1762152.pdf> Ohmite B20 <https://www.ohmite.com/assets/docs/res_200.pdf?r=false>; DKPN: RT0603BRB0714KL-ND; MANUFACTURER: YAGEO; MOPN: 603-RT0603BRB0714KL; MPN: RT0603BRB0714KL; POWER: 0.1W; RESISTANCE: 14k; TOLERANCE: 0.1%; VOLTAGE_CONTINUOUS: 37.4V; VOLTAGE_MAX: 75V
R92 R94 R95 R97 = HyTechDevices:RESISTOR_?_*: Resistor PWR163 Series <https://www.mouser.com/datasheet/2/54/pwr163-777985.pdf> AC Series <https://www.mouser.com/datasheet/2/447/Yageo_PYu_AC_51_RoHS_L_7_1714230-1874691.pdf> PU Series <https://www.mouser.com/datasheet/2/447/PYu-PU_51_RoHS_L_6-1504619.pdf> ERA Series <https://www.mouser.com/datasheet/2/315/AOA0000C307-1149632.pdf> PWR263 Series <https://www.mouser.com/datasheet/2/54/pwr263s_35-778069.pdf> KTR Series <https://www.mouser.com/datasheet/2/348/ROHM_S_A0011075115_1-2563276.pdf> RC Series <https://www.mouser.com/datasheet/2/447/Yageo_03_18_2021_PYu_RC_Group_51_RoHS_L_11-2199992.pdf> ERJ PB3, PB6 Series <https://www.mouser.com/datasheet/2/315/AOA0000C328-1530132.pdf> ERJ PA2, P03, PA3, P06, P08, P14 Series <https://www.mouser.com/datasheet/2/315/AOA0000C331-1141874.pdf> B20 Series <https://www.ohmite.com/assets/docs/res_200.pdf?r=false> TE Connectivity/Holsworthy RN73 Series <https://www.mouser.com/datasheet/2/418/4/NG_DS_1773270_M-604713.pdf> Vishay Dale D/CRCW e3 <https://www.mouser.com/datasheet/2/427/dcrcwe3-1762152.pdf> Ohmite B20 <https://www.ohmite.com/assets/docs/res_200.pdf?r=false>; DKPN: 311-5.10KHRTR-ND; MANUFACTURER: Yageo; MOPN: 603-RC0603FR-075K1L; MPN: RC0603FR-075K1L; POWER: 0.1W; RESISTANCE: 5.1k; TOLERANCE: 1%; VOLTAGE_CONTINUOUS: 22.58V; VOLTAGE_MAX: 75V
S1 = HyTechDevices:BUTTON: Button Datasheet <https://www.mouser.com/datasheet/2/307/en_b3s-1221332.pdf>; DKPN: SW415-ND; MANUFACTURER: Omron; MOPN: 653-B3S-1000; MPN: B3S-1000
TP1-TP10 = HyTechDevices:TEST_POINT: Test Point for Probing; DKPN: 36-5015CT-ND; MANUFACTURER: Keystone Electronics; MOPN: 534-5015; MPN: 5015
U1-U4 U6-U9 U35 U36 U38 = HyTechDevices:MAX74*: 8th-Order Maxim Filter MAX7480 Datasheet <https://www.mouser.com/datasheet/2/256/MAX7480-1515905.pdf> MAX7400 Datsheet <https://www.mouser.com/datasheet/2/256/MAX7404-1514314.pdf> Recommended clock capacitor for the MAX7400/MAX7404: 885012006013 <https://www.mouser.com/datasheet/2/445/885012006013-1726946.pdf>; DKPN: MAX7400CSA+-ND; MANUFACTURER: Maxim Integrated; MOPN: 700-MAX7400CSA; MPN: MAX7400CSA+
U5 = HyTechDevices:VOLTAGE_REGULATOR_?_*: Voltage Regulators LDL1117S50R Datasheet <https://www.mouser.com/datasheet/2/389/dm00366442-1799212.pdf> NCP785AH120T1G <https://www.mouser.com/datasheet/2/308/NCP785A_D-1812704.pdf> LMS8117A Datasheet <https://www.ti.com/lit/ds/symlink/lms8117a.pdf?HQS> ST732M50R Datasheet <https://www.mouser.com/datasheet/2/389/st732-1830546.pdf> LM2937IMPX-10/NOPB Datasheet <https://www.ti.com/lit/ds/symlink/lm2937.pdf> L78L15ACUTR Datasheet <https://www.mouser.com/datasheet/2/389/l78l-1849295.pdf>; DKPN: LMS8117AMP-3.3/NOPBCT-ND; MANUFACTURER: Texas Instruments; MOPN: 926-LMS8117AMP33NOPB; MPN: LMS8117AMP-3.3/NOPB
U10 U11 = Temp:MCP3208
U12 U13 U31-U34 = HyTechDevices:TCAN1051*V-Q1: TCAN1051*V Can Tranciever Datasheet <https://www.ti.com/lit/ds/symlink/tcan1051hgv-q1.pdf?HQS=dis-mous-null-mousermode-dsf-pf-null-wwe&ts=1610765132518&ref_url=https%253A%252F%252Fwww.mouser.com%252Ff>; DKPN: 296-49935-1-ND; MANUFACTURER: Texas Instruments; MOPN: 595-TCAN1051HGVDQ1; MPN: TCAN1051HGVDRQ1
U15 U17 U19 U22 U25-U27 U29 U30 = HyTechDevices:OPAMP_1_CHANNEL_*: Op-Amp 1 Channel OPA991 Datasheet <https://www.ti.com/lit/ds/symlink/opa991.pdf?ts=1615503614502> Note: OPA991 is also a comparator; DKPN: 296-OPA991IDCKRCT-ND; MANUFACTURER: Texas Instruments; MOPN: 595-OPA991IDCKR; MPN: OPA991IDCKR
U16 U18 U20 U21 U24 = HyTechDevices:LOGICGATE_OR: OR Gate SN74LVC Datasheet <https://www.ti.com/lit/ds/symlink/sn74lvc1g34.pdf>; DKPN: 296-22348-2-ND; MANUFACTURER: Texas Instruments; MOPN: 595-SN74LVC32IDCKREP; MPN: SN74LVC1G32IDCKREP
U23 = HyTechDevices:LOGICGATE_NOR: NOR Gate SN74LVC Datasheet <https://www.ti.com/lit/ds/symlink/sn74lvc1g02.pdf>; DKPN: 296-11598-1-ND; MANUFACTURER: Texas Instruments; MOPN: 595-SN74LVC1G02DCKR; MPN: SN74LVC1G02DCKR
U28 = HyTechDevices:LOGICGATE_AND_: AND Gate SN74LVC Datasheet <https://www.ti.com/lit/ds/symlink/sn74lvc1g08.pdf>; DKPN: 296-SN74LVC1G08DCK3TR-ND; MANUFACTURER: Texas Instruments; MOPN: 595-SN74LVC1G08DCK3; MPN: SN74LVC1G08DCK3
U37 = HyTechDevices:ADM8316: ADM8316 Watchdog Datasheet <https://www.mouser.com/datasheet/2/609/adm8316_8318_8319_8320_8321_8322-1503275.pdf>; DKPN: ADM8316WBX30ARJZR7TR-ND; MANUFACTURER: Analog Devices Inc.; MOPN: 584-M8316WBX30ARJZR7; MPN: ADM8316WBX30ARJZR7; RESET_VOLTAGE: 3V; TIMEOUT: 102ms
VR1 VR2 = HyTechDevices:RESISTOR_TRIMPOT_*_?: Variable Resistor Bourns 3362P Datasheet <https://www.mouser.com/datasheet/2/54/3362-776956.pdf>; DKPN: 3362P-103LF-ND; MANUFACTURER: Bourns Inc.; MOPN: 652-3362P-1-103LF; MPN: 3362P-1-103LF; POWER: 0.5W; RESISTANCE: 10k; TOLERANCE: 10%; VOLTAGE: 70.711V
XB1 = HyTechDevices:BATTERY_HOLDER_*: Keystone 498 1/3N Cell Holder PN for the holder; if 1/3N batteries needed, order separately. Datasheet <https://www.mouser.com/datasheet/2/215/98-745913.pdf>; BATTERY_TYPE: 1/3N; DKPN: 36-498-ND; MANUFACTURER: Keystone Electronics; MOPN: 534-498; MPN: 498